# EAGLE design base1.1 (EAGLE 5.06)

## Sheet 1 of 3
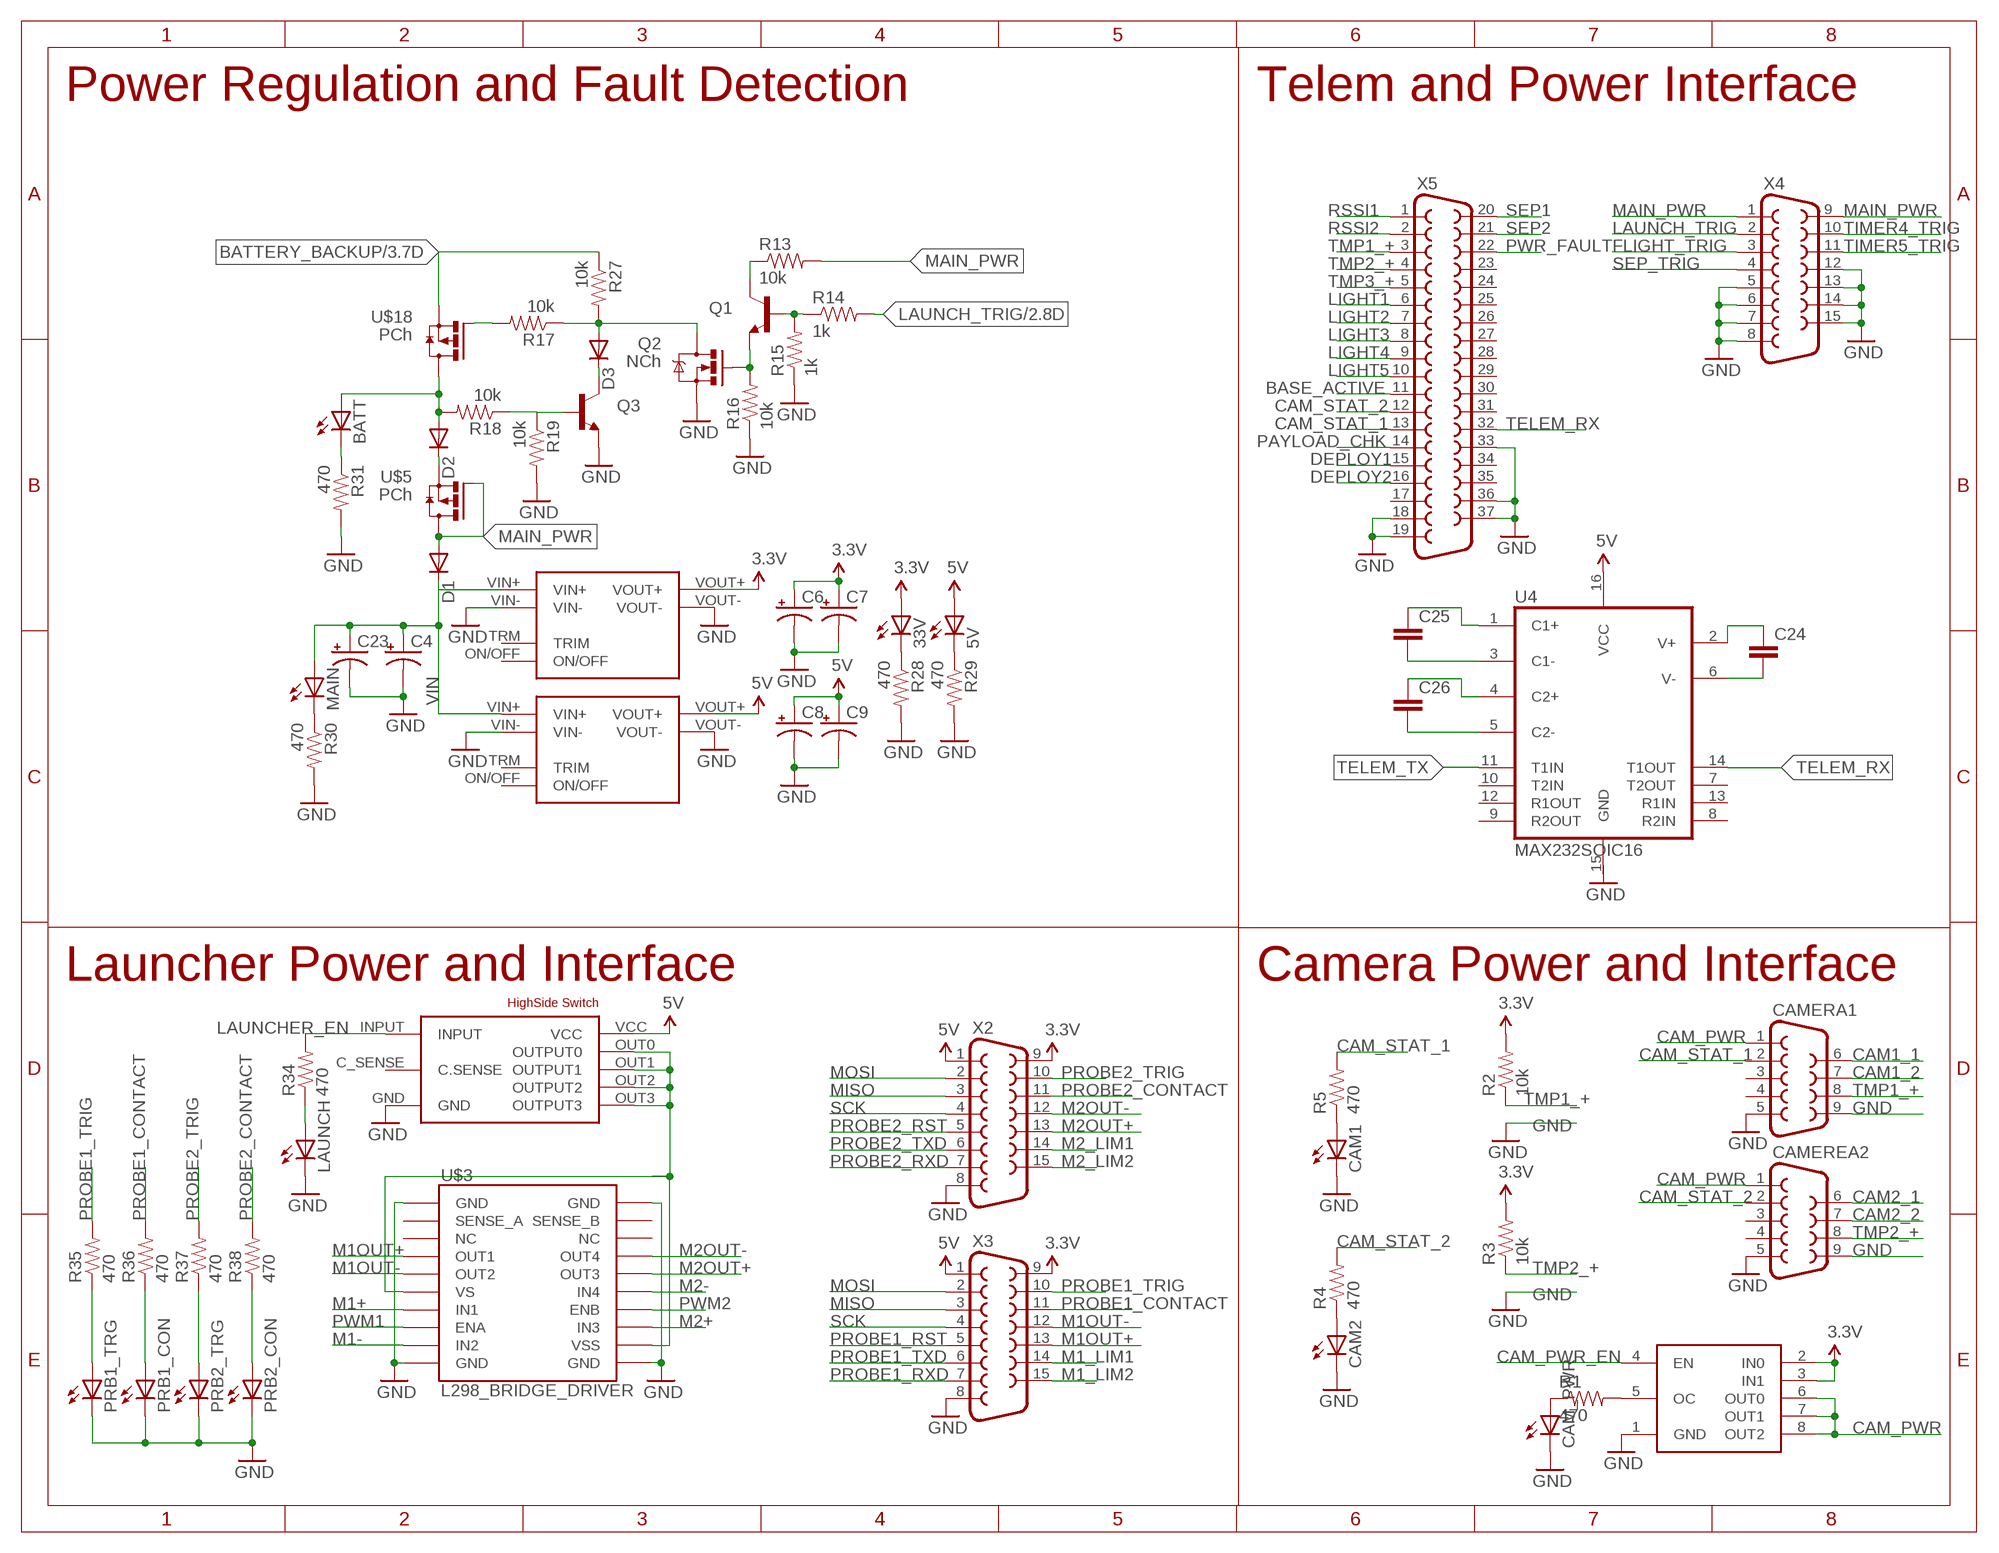
[diagram p0: schematic, sheet 1]

### Parts
3.3V  UEI15-033-Q12  [UEI15]
5.0V  UEI15-050-Q12  [UEI15]
5V  LEDCHIP-LED0805  [CHIP-LED0805]
33V  LEDCHIP-LED0805  [CHIP-LED0805]
BATT  LEDCHIP-LED0805  [CHIP-LED0805]
C4  CAP_POLF80  [NIPPON_F80]
C6  CAP_POLF80  [NIPPON_F80]
C7  CAP_POLF80  [NIPPON_F80]
C8  CAP_POLF80  [NIPPON_F80]
C9  CAP_POLF80  [NIPPON_F80]
C23  CAP_POLF80  [NIPPON_F80]
C24  CAP0805  [0805]
C25  CAP0805  [0805]
C26  CAP0805  [0805]
CAM1  LEDCHIP-LED0805  [CHIP-LED0805]
CAM2  LEDCHIP-LED0805  [CHIP-LED0805]
CAM_PWR  LEDCHIP-LED0805  [CHIP-LED0805]
CAMERA1  F09VB  [F09VB]
CAMEREA2  F09VB  [F09VB]
D1  DIODE-SMC  [SMC]
D2  DIODE-SMC  [SMC]
D3  DIODESOD  [SOD-323]
LAUNCH  LEDCHIP-LED0805  [CHIP-LED0805]
MAIN  LEDCHIP-LED0805  [CHIP-LED0805]
PRB1_CON  LEDCHIP-LED0805  [CHIP-LED0805]
PRB1_TRG  LEDCHIP-LED0805  [CHIP-LED0805]
PRB2_CON  LEDCHIP-LED0805  [CHIP-LED0805]
PRB2_TRG  LEDCHIP-LED0805  [CHIP-LED0805]
Q1  TRANSISTOR_NPNSOT23-3  [SOT23-3]
Q2  NCh  MOSFET-NCHANNELSMD  [SOT23-3]
Q3  TRANSISTOR_NPNSOT23-3  [SOT23-3]
R1  470  RESISTOR  [0805]
R2  10k  RESISTOR  [0805]
R3  10k  RESISTOR  [0805]
R4  470  RESISTOR  [0805]
R5  470  RESISTOR  [0805]
R13  10k  RESISTOR  [0805]
R14  1k  RESISTOR  [0805]
R15  1k  RESISTOR  [0805]
R16  10k  RESISTOR  [0805]
R17  10k  RESISTOR  [0805]
R18  10k  RESISTOR  [0805]
R19  10k  RESISTOR  [0805]
R27  10k  RESISTOR  [0805]
R28  470  RESISTOR  [0805]
R29  470  RESISTOR  [0805]
R30  470  RESISTOR  [0805]
R31  470  RESISTOR  [0805]
R34  470  RESISTOR  [0805]
R35  470  RESISTOR  [0805]
R36  470  RESISTOR  [0805]
R37  470  RESISTOR  [0805]
R38  470  RESISTOR  [0805]
U4  MAX232SOIC16  [SO016]
U$2  TPS2034D  [SO-08]
U$3  L298_BRIDGE_DRIVER  [POWERSO20]
U$5  PCh  IRFR5505  [D-PAK_TO252AA]
U$17  VN920SP  [POWERS0-10]
U$18  PCh  IRFR5505  [D-PAK_TO252AA]
X2  F15VB  [F15VB]
X3  F15VB  [F15VB]
X4  F15VB  [F15VB]
X5  F37VB  [F37VB]

### Nets
3.3V: 3.3V.VOUT+ 33V.A C6.+ C7.+ R2.2 R3.2 U$2.2(IN0) U$2.3(IN1) X2.9 X3.9 ; also sheet 2,3
5V: 5.0V.VOUT+ 5V.A C8.+ C9.+ U4.16(VCC) U$17.VCC X2.1 X3.1 ; also sheet 2,3
BASE_ACTIVE: X5.11
BATTERY_BACKUP: R27.1 U$18.3(S) ; also sheet 3
CAM1_1: CAMERA1.6 ; also sheet 2
CAM1_2: CAMERA1.7 ; also sheet 2
CAM2_1: CAMEREA2.6 ; also sheet 2
CAM2_2: CAMEREA2.7 ; also sheet 2
CAM_PWR: CAMERA1.1 CAMEREA2.1 U$2.6(OUT0) U$2.7(OUT1) U$2.8(OUT2)
CAM_PWR_EN: U$2.4(EN) ; also sheet 2
CAM_STAT_1: CAMERA1.2 R5.2 X5.13 ; also sheet 2
CAM_STAT_2: CAMEREA2.2 R4.2 X5.12 ; also sheet 2
DEPLOY1: X5.15
DEPLOY2: X5.16
FLIGHT_TRIG: X4.3 ; also sheet 2
GND: 3.3V.VIN- 3.3V.VOUT- 5.0V.VIN- 5.0V.VOUT- C4.- C6.- C7.- C8.- C9.- C23.- CAM1.C CAM2.C CAM_PWR.C CAMERA1.5 CAMERA1.9 CAMEREA2.5 CAMEREA2.9 LAUNCH.C PRB1_CON.C PRB1_TRG.C PRB2_CON.C PRB2_TRG.C Q2.2(S) Q3.2(E) R15.1 R16.1 R19.2 R28.2 R29.2 R30.2 R31.2 U$2.1(GND) U$3.P$1(GND) U$3.P$10(GND) U$3.P$11(GND) U$3.P$20(GND) U$17.GND X2.8 X3.8 X4.5 X4.6 X4.7 X4.8 X4.12 X4.13 X4.14 X4.15 X5.18 X5.19 X5.33 X5.36 X5.37 ; also sheet 2,3
LAUNCH_TRIG: R14.2 X4.2 ; also sheet 2
LAUNCHER_EN: R34.2 U$17.INPUT
LIGHT1: X5.6 ; also sheet 2,3
LIGHT2: X5.7 ; also sheet 2,3
LIGHT3: X5.8 ; also sheet 2,3
LIGHT4: X5.9 ; also sheet 2,3
LIGHT5: X5.10
M1+: U$3.P$7(IN1) ; also sheet 2
M1-: U$3.P$9(IN2) ; also sheet 2
M1_LIM1: X3.14
M1_LIM2: X3.15
M1OUT+: U$3.P$4(OUT1) X3.13
M1OUT-: U$3.P$5(OUT2) X3.12
M2+: U$3.P$13(IN3) ; also sheet 2
M2-: U$3.P$15(IN4) ; also sheet 2
M2_LIM1: X2.14
M2_LIM2: X2.15
M2OUT+: U$3.P$16(OUT3) X2.13
M2OUT-: U$3.P$17(OUT4) X2.12
MAIN_PWR: D1.A R13.2 U$5.1(G) U$5.4(D) X4.1 X4.9
MISO: X2.3 X3.3 ; also sheet 2,3
MOSI: X2.2 X3.2 ; also sheet 2,3
N$1: R1.2 U$2.5(OC)
N$2: CAM_PWR.A R1.1
N$3: CAM1.A R5.1
N$4: CAM2.A R4.1
N$6: Q1.2(E) Q2.1(G) R16.2
N$8: D2.C U$5.3(S)
N$15: BATT.A D2.A R18.2 U$18.4(D)
N$16: Q1.3(C) R13.1
N$18: Q1.1(B) R14.1 R15.2
N$19: D3.1(C) Q3.3(C)
N$23: R17.2 U$18.1(G)
N$25: U$3.P$6(VS) U$3.P$12(VSS) U$17.OUT0(OUTPUT0) U$17.OUT1(OUTPUT1) U$17.OUT2(OUTPUT2) U$17.OUT3(OUTPUT3)
N$26: Q3.1(B) R18.1 R19.1
N$44: D3.2(A) Q2.3(D) R17.1 R27.2
N$48: 33V.C R28.1
N$49: 5V.C R29.1
N$50: MAIN.C R30.1
N$51: BATT.C R31.1
N$52: LAUNCH.A R34.1
N$54: C25.1 U4.1(C1+)
N$55: C25.2 U4.3(C1-)
N$56: C26.2 U4.5(C2-)
N$57: C26.1 U4.4(C2+)
N$58: C24.1 U4.2(V+)
N$59: C24.2 U4.6(V-)
N$60: PRB1_TRG.A R35.1
N$61: PRB1_CON.A R36.1
N$62: PRB2_TRG.A R37.1
N$63: PRB2_CON.A R38.1
PAYLOAD_CHK: X5.14
PROBE1_CONTACT: R36.2 X3.11 ; also sheet 2
PROBE1_RST: X3.5 ; also sheet 3
PROBE1_RXD: X3.7 ; also sheet 3
PROBE1_TRIG: R35.2 X3.10 ; also sheet 2,3
PROBE1_TXD: X3.6 ; also sheet 3
PROBE2_CONTACT: R38.2 X2.11 ; also sheet 2
PROBE2_RST: X2.5 ; also sheet 3
PROBE2_RXD: X2.7 ; also sheet 3
PROBE2_TRIG: R37.2 X2.10 ; also sheet 2,3
PROBE2_TXD: X2.6 ; also sheet 3
PWM1: U$3.P$8(ENA) ; also sheet 2
PWM2: U$3.P$14(ENB) ; also sheet 2
PWR_FAULT: X5.22
RSSI1: X5.1 ; also sheet 2
RSSI2: X5.2 ; also sheet 2
SCK: X2.4 X3.4 ; also sheet 2,3
SEP1: X5.20
SEP2: X5.21
SEP_TRIG: X4.4 ; also sheet 2
TELEM_RX: U4.14(T1OUT) X5.32
TELEM_TX: U4.11(T1IN) ; also sheet 2
TIMER4_TRIG: X4.10
TIMER5_TRIG: X4.11
TMP1_+: CAMERA1.8 R2.1 X5.3
TMP2_+: CAMEREA2.8 R3.1 X5.4
TMP3_+: X5.5
VIN: 3.3V.VIN+ 5.0V.VIN+ C4.+ C23.+ D1.C MAIN.A
Unconnected: 3.3V.ON/OFF 3.3V.TRM(TRIM) 5.0V.ON/OFF 5.0V.TRM(TRIM) CAMERA1.3 CAMERA1.4 CAMEREA2.3 CAMEREA2.4 U4.7(T2OUT) U4.8(R2IN) U4.9(R2OUT) U4.10(T2IN) U4.12(R1OUT) U4.13(R1IN) U4.15(GND) U$3.P$2(SENSE_A) U$3.P$3(NC) U$3.P$18(NC) U$3.P$19(SENSE_B) U$17.C_SENSE(C.SENSE) X5.17 X5.23 X5.24 X5.25 X5.26 X5.27 X5.28 X5.29 X5.30 X5.31 X5.34 X5.35

### Notes on the sheet
- Power Regulation and Fault Detection | Telem and Power Interface
- Launcher Power and Interface | Camera Power and Interface

## Sheet 2 of 3
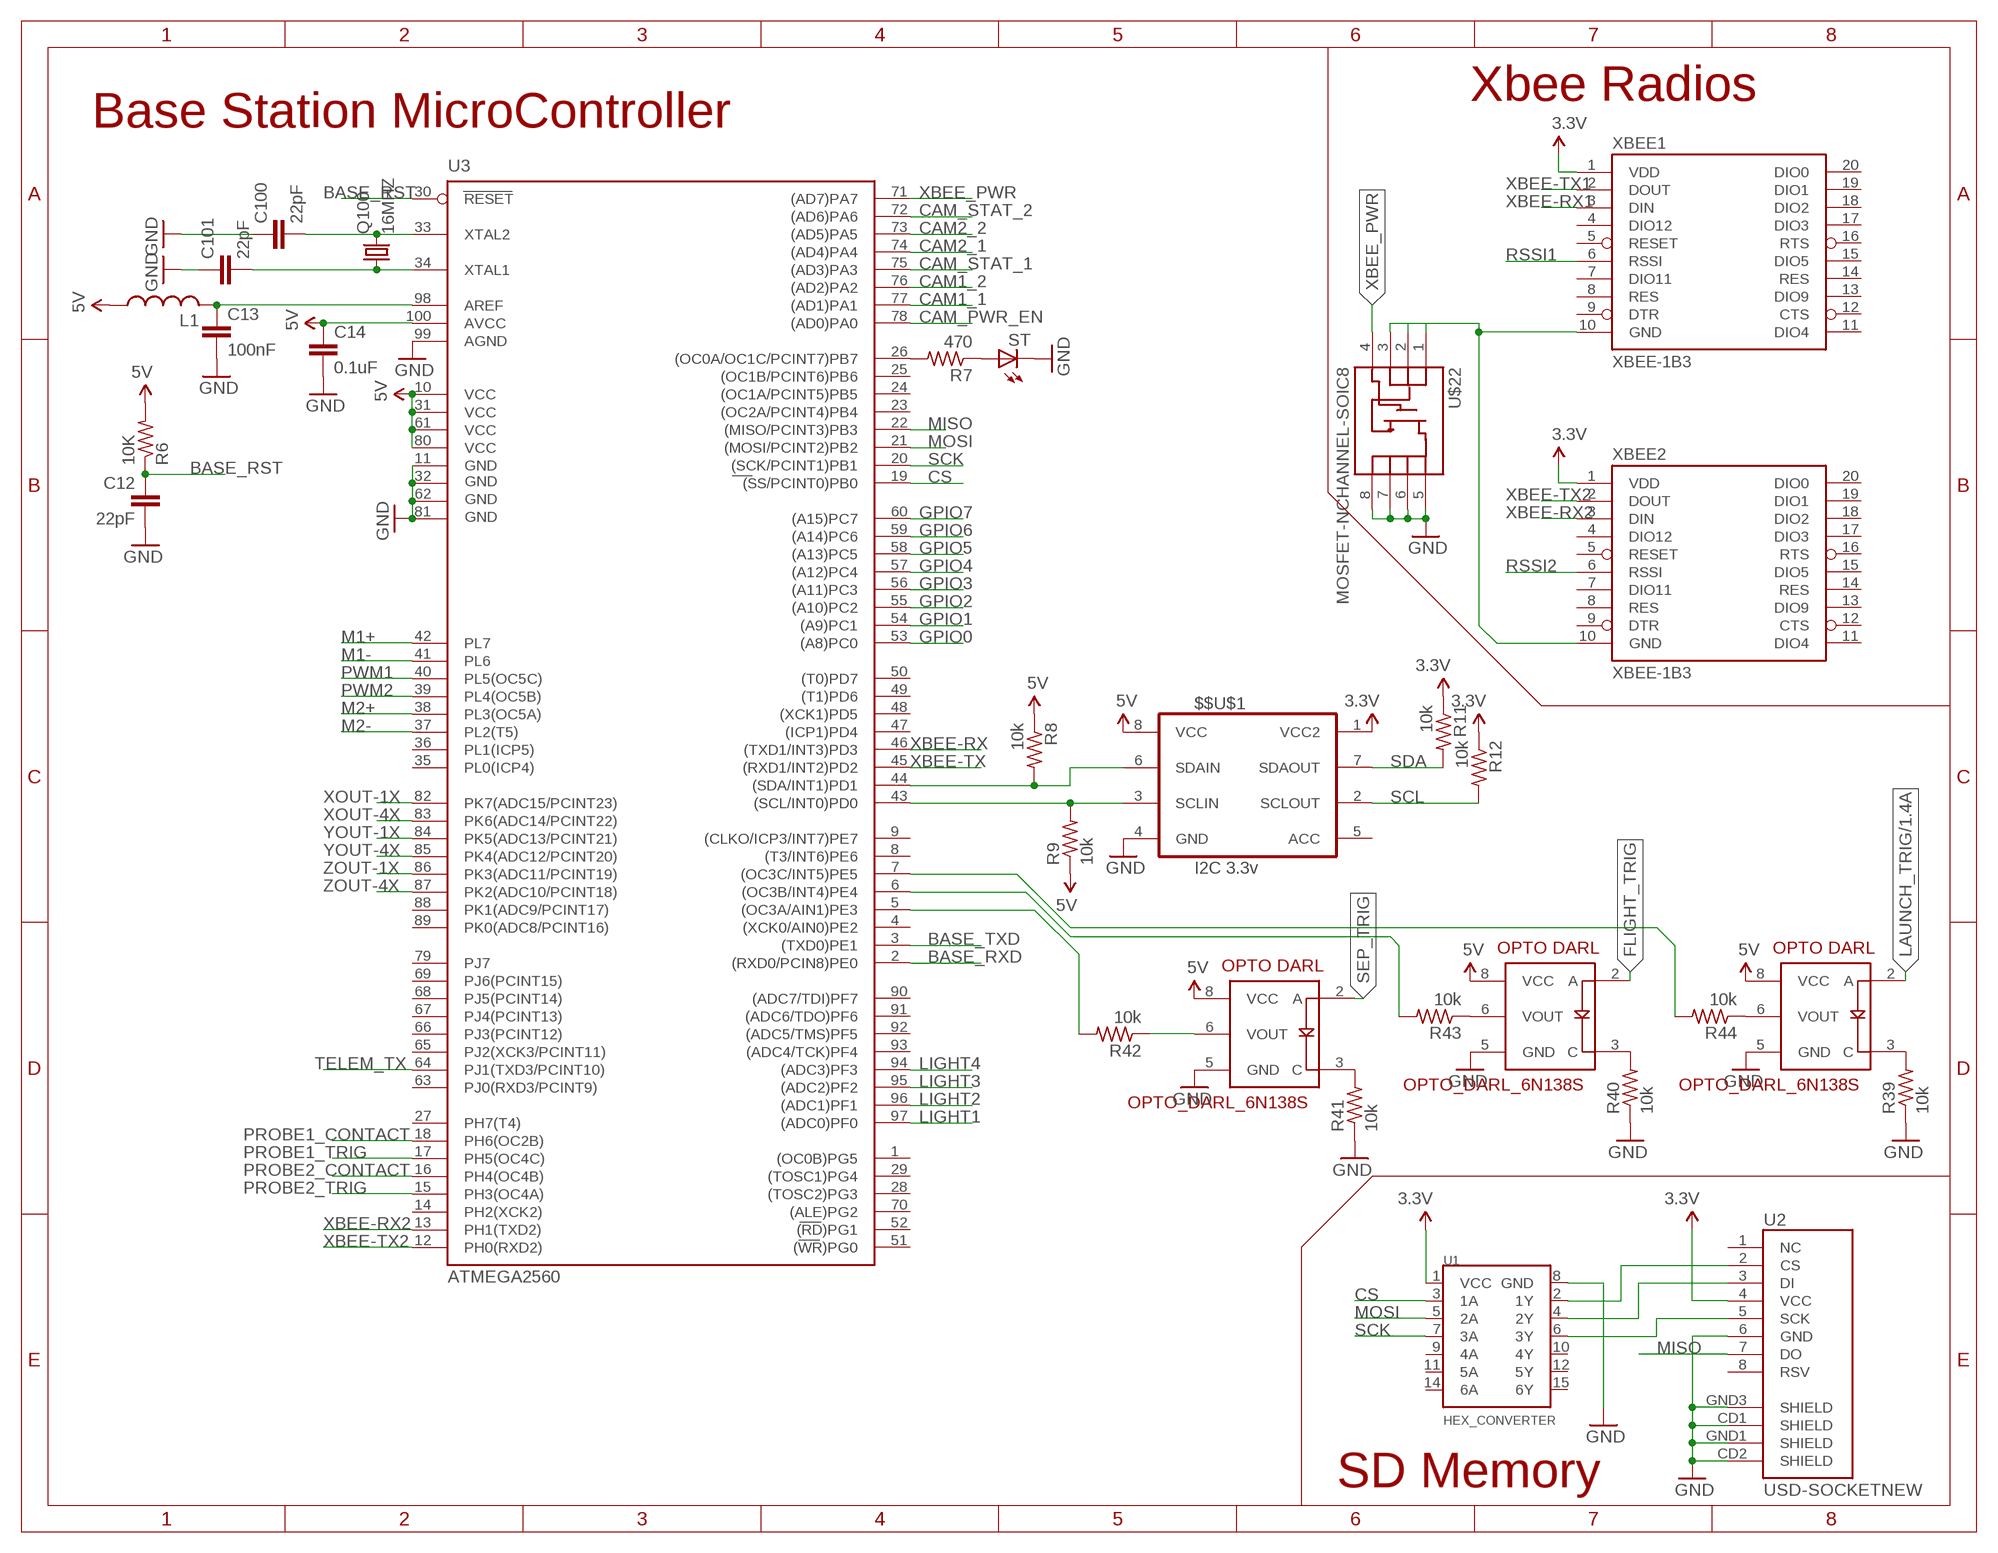
[diagram p1: schematic, sheet 2]

### Parts
$$U$1  I2C 3.3v  CUSTOM2_PCA9512A  [CUSTOM2_SO08]
C12  22pF  C-EUC0805K  [C0805K]
C13  100nF  C-EUC0805K  [C0805K]
C14  0.1uF  C-EUC0805K  [C0805K]
C100  22pF  C-EUC0805K  [C0805K]
C101  22pF  C-EUC0805K  [C0805K]
L1  L-USL2012C  [L2012C]
Q100  16MHZ  CRYSTAL5X3  [CRYSTAL-SMD-5X3]
R6  10K  R-US_M0805  [M0805]
R7  470  R-US_M0805  [M0805]
R8  10k  R-US_M0805  [M0805]
R9  10k  R-US_M0805  [M0805]
R11  10k  R-US_M0805  [M0805]
R12  10k  R-US_M0805  [M0805]
R39  10k  R-US_M0805  [M0805]
R40  10k  R-US_M0805  [M0805]
R41  10k  R-US_M0805  [M0805]
R42  10k  R-US_M0805  [M0805]
R43  10k  R-US_M0805  [M0805]
R44  10k  R-US_M0805  [M0805]
ST  LED1206  [LED-1206]
U1  HEX_CONVERTER  [SO016]
U2  USD-SOCKETNEW  [MICRO-SD-SOCKET-PP]
U3  ATMEGA2560  ATMEGA2560-16AU  [TQFP100]
U$22  MOSFET-NCHANNEL-SOIC8  [SO08]
U$28  OPTO_DARL_6N138S  [8-SMD]
U$29  OPTO_DARL_6N138S  [8-SMD]
U$30  OPTO_DARL_6N138S  [8-SMD]
XBEE1  XBEE-1B3  [XBEE-SMD]
XBEE2  XBEE-1B3  [XBEE-SMD]

### Nets
3.3V: $$U$1.1(VCC2) R11.1 R12.1 U1.1(VCC) U2.4(VCC) XBEE1.1(VDD) XBEE2.1(VDD) ; also sheet 1,3
5V: $$U$1.8(VCC) C14.1 L1.1 R6.2 R8.1 R9.1 U3.10(VCC) U3.31(VCC1) U3.61(VCC2) U3.80(VCC3) U3.100(AVCC) U$28.8(VCC) U$29.8(VCC) U$30.8(VCC) ; also sheet 1,3
BASE_RST: C12.1 R6.1 U3.30(RESET) ; also sheet 3
BASE_RXD: U3.2((RXD0/PCIN8)PE0) ; also sheet 3
BASE_TXD: U3.3((TXD0)PE1) ; also sheet 3
CAM1_1: U3.77((AD1)PA1) ; also sheet 1
CAM1_2: U3.76((AD2)PA2) ; also sheet 1
CAM2_1: U3.74((AD4)PA4) ; also sheet 1
CAM2_2: U3.73((AD5)PA5) ; also sheet 1
CAM_PWR_EN: U3.78((AD0)PA0) ; also sheet 1
CAM_STAT_1: U3.75((AD3)PA3) ; also sheet 1
CAM_STAT_2: U3.72((AD6)PA6) ; also sheet 1
CS: U1.3(1A) U3.19((SS/PCINT0)PB0)
FLIGHT_TRIG: U$29.2(A) ; also sheet 1
GND: $$U$1.4(GND) C12.2 C13.2 C14.2 C100.1 C101.1 R39.1 R40.1 R41.1 ST.C U1.8(GND) U2.6(GND) U2.CD1(SHIELD) U2.CD2(SHIELD) U2.GND1(SHIELD) U2.GND3(SHIELD) U3.11(GND) U3.32(GND1) U3.62(GND2) U3.81(GND3) U3.99(AGND) U$22.5(D) U$22.6(D) U$22.7(D) U$22.8(D) U$28.5(GND) U$29.5(GND) U$30.5(GND) ; also sheet 1,3
GPIO0: U3.53((A8)PC0) ; also sheet 3
GPIO1: U3.54((A9)PC1) ; also sheet 3
GPIO2: U3.55((A10)PC2) ; also sheet 3
GPIO3: U3.56((A11)PC3) ; also sheet 3
GPIO4: U3.57((A12)PC4)
GPIO5: U3.58((A13)PC5)
GPIO6: U3.59((A14)PC6)
GPIO7: U3.60((A15)PC7)
LAUNCH_TRIG: U$30.2(A) ; also sheet 1
LIGHT1: U3.97((ADC0)PF0) ; also sheet 1,3
LIGHT2: U3.96((ADC1)PF1) ; also sheet 1,3
LIGHT3: U3.95((ADC2)PF2) ; also sheet 1,3
LIGHT4: U3.94((ADC3)PF3) ; also sheet 1,3
M1+: U3.42(PL7) ; also sheet 1
M1-: U3.41(PL6) ; also sheet 1
M2+: U3.38(PL3(OC5A)) ; also sheet 1
M2-: U3.37(PL2(T5)) ; also sheet 1
MISO: U2.7(DO) U3.22((MISO/PCINT3)PB3) ; also sheet 1,3
MOSI: U1.5(2A) U3.21((MOSI/PCINT2)PB2) ; also sheet 1,3
N$5: $$U$1.3(SCLIN) R9.2 U3.43((SCL/INT0)PD0)
N$7: C13.1 L1.2 U3.98(AREF)
N$9: $$U$1.6(SDAIN) R8.2 U3.44((SDA/INT1)PD1)
N$10: U1.2(1Y) U2.2(CS)
N$11: U1.4(2Y) U2.3(DI)
N$12: U1.6(3Y) U2.5(SCK)
N$13: C100.2 Q100.3 U3.33(XTAL2)
N$14: C101.2 Q100.1 U3.34(XTAL1)
N$29: R7.2 U3.26((OC0A/OC1C/PCINT7)PB7)
N$30: R7.1 ST.A
N$35: R44.2 U3.7((OC3C/INT5)PE5)
N$36: R43.2 U3.6((OC3B/INT4)PE4)
N$37: R42.2 U3.5((OC3A/AIN1)PE3)
N$38: R39.2 U$30.3(C)
N$39: R40.2 U$29.3(C)
N$40: R41.2 U$28.3(C)
N$41: R42.1 U$28.6(VOUT)
N$43: R44.1 U$30.6(VOUT)
N$53: U$22.1(S) U$22.2(S) U$22.3(S) XBEE1.10(GND) XBEE2.10(GND)
N$64: R43.1 U$29.6(VOUT)
PROBE1_CONTACT: U3.18(PH6(OC2B)) ; also sheet 1
PROBE1_TRIG: U3.17(PH5(OC4C)) ; also sheet 1,3
PROBE2_CONTACT: U3.16(PH4(OC4B)) ; also sheet 1
PROBE2_TRIG: U3.15(PH3(OC4A)) ; also sheet 1,3
PWM1: U3.40(PL5(OC5C)) ; also sheet 1
PWM2: U3.39(PL4(OC5B)) ; also sheet 1
RSSI1: XBEE1.6(RSSI) ; also sheet 1
RSSI2: XBEE2.6(RSSI) ; also sheet 1
SCK: U1.7(3A) U3.20((SCK/PCINT1)PB1) ; also sheet 1,3
SCL: $$U$1.2(SCLOUT) R12.2 ; also sheet 3
SDA: $$U$1.7(SDAOUT) R11.2 ; also sheet 3
SEP_TRIG: U$28.2(A) ; also sheet 1
TELEM_TX: U3.64(PJ1(TXD3/PCINT10)) ; also sheet 1
XBEE-RX: U3.46((TXD1/INT3)PD3)
XBEE-RX1: XBEE1.3(DIN)
XBEE-RX2: U3.13(PH1(TXD2)) XBEE2.3(DIN)
XBEE-TX: U3.45((RXD1/INT2)PD2)
XBEE-TX1: XBEE1.2(DOUT)
XBEE-TX2: U3.12(PH0(RXD2)) XBEE2.2(DOUT)
XBEE_PWR: U$22.4(G)
XOUT-1X: U3.82(PK7(ADC15/PCINT23)) ; also sheet 3
XOUT-4X: U3.83(PK6(ADC14/PCINT22)) ; also sheet 3
YOUT-1X: U3.84(PK5(ADC13/PCINT21)) ; also sheet 3
YOUT-4X: U3.85(PK4(ADC12/PCINT20)) ; also sheet 3
ZOUT-1X: U3.86(PK3(ADC11/PCINT19)) ; also sheet 3
ZOUT-4X: U3.87(PK2(ADC10/PCINT18)) ; also sheet 3
Unconnected: $$U$1.5(ACC) U1.9(4A) U1.10(4Y) U1.11(5A) U1.12(5Y) U1.14(6A) U1.15(6Y) U2.1(NC) U2.8(RSV) U3.1((OC0B)PG5) U3.4((XCK0/AIN0)PE2) U3.8((T3/INT6)PE6) U3.9((CLKO/ICP3/INT7)PE7) U3.14(PH2(XCK2)) U3.23((OC2A/PCINT4)PB4) U3.24((OC1A/PCINT5)PB5) U3.25((OC1B/PCINT6)PB6) U3.27(PH7(T4)) U3.28((TOSC2)PG3) U3.29((TOSC1)PG4) U3.35(PL0(ICP4)) U3.36(PL1(ICP5)) U3.47((ICP1)PD4) U3.48((XCK1)PD5) U3.49((T1)PD6) U3.50((T0)PD7) U3.51((WR)PG0) U3.52((RD)PG1) U3.63(PJ0(RXD3/PCINT9)) U3.65(PJ2(XCK3/PCINT11)) U3.66(PJ3(PCINT12)) U3.67(PJ4(PCINT13)) U3.68(PJ5(PCINT14)) U3.69(PJ6(PCINT15)) U3.70((ALE)PG2) U3.71((AD7)PA7) U3.79(PJ7) U3.88(PK1(ADC9/PCINT17)) U3.89(PK0(ADC8/PCINT16)) U3.90((ADC7/TDI)PF7) U3.91((ADC6/TDO)PF6) U3.92((ADC5/TMS)PF5) U3.93((ADC4/TCK)PF4) XBEE1.4(DIO12) XBEE1.5(RESET) XBEE1.7(DIO11) XBEE1.8(RES) XBEE1.9(DTR) XBEE1.11(DIO4) XBEE1.12(CTS) XBEE1.13(DIO9) XBEE1.14(RES) XBEE1.15(DIO5) XBEE1.16(RTS) XBEE1.17(DIO3) XBEE1.18(DIO2) XBEE1.19(DIO1) XBEE1.20(DIO0) XBEE2.4(DIO12) XBEE2.5(RESET) XBEE2.7(DIO11) XBEE2.8(RES) XBEE2.9(DTR) XBEE2.11(DIO4) XBEE2.12(CTS) XBEE2.13(DIO9) XBEE2.14(RES) XBEE2.15(DIO5) XBEE2.16(RTS) XBEE2.17(DIO3) XBEE2.18(DIO2) XBEE2.19(DIO1) XBEE2.20(DIO0)

### Notes on the sheet
- Xbee Radios
- Base Station MicroController
- SD Memory

## Sheet 3 of 3
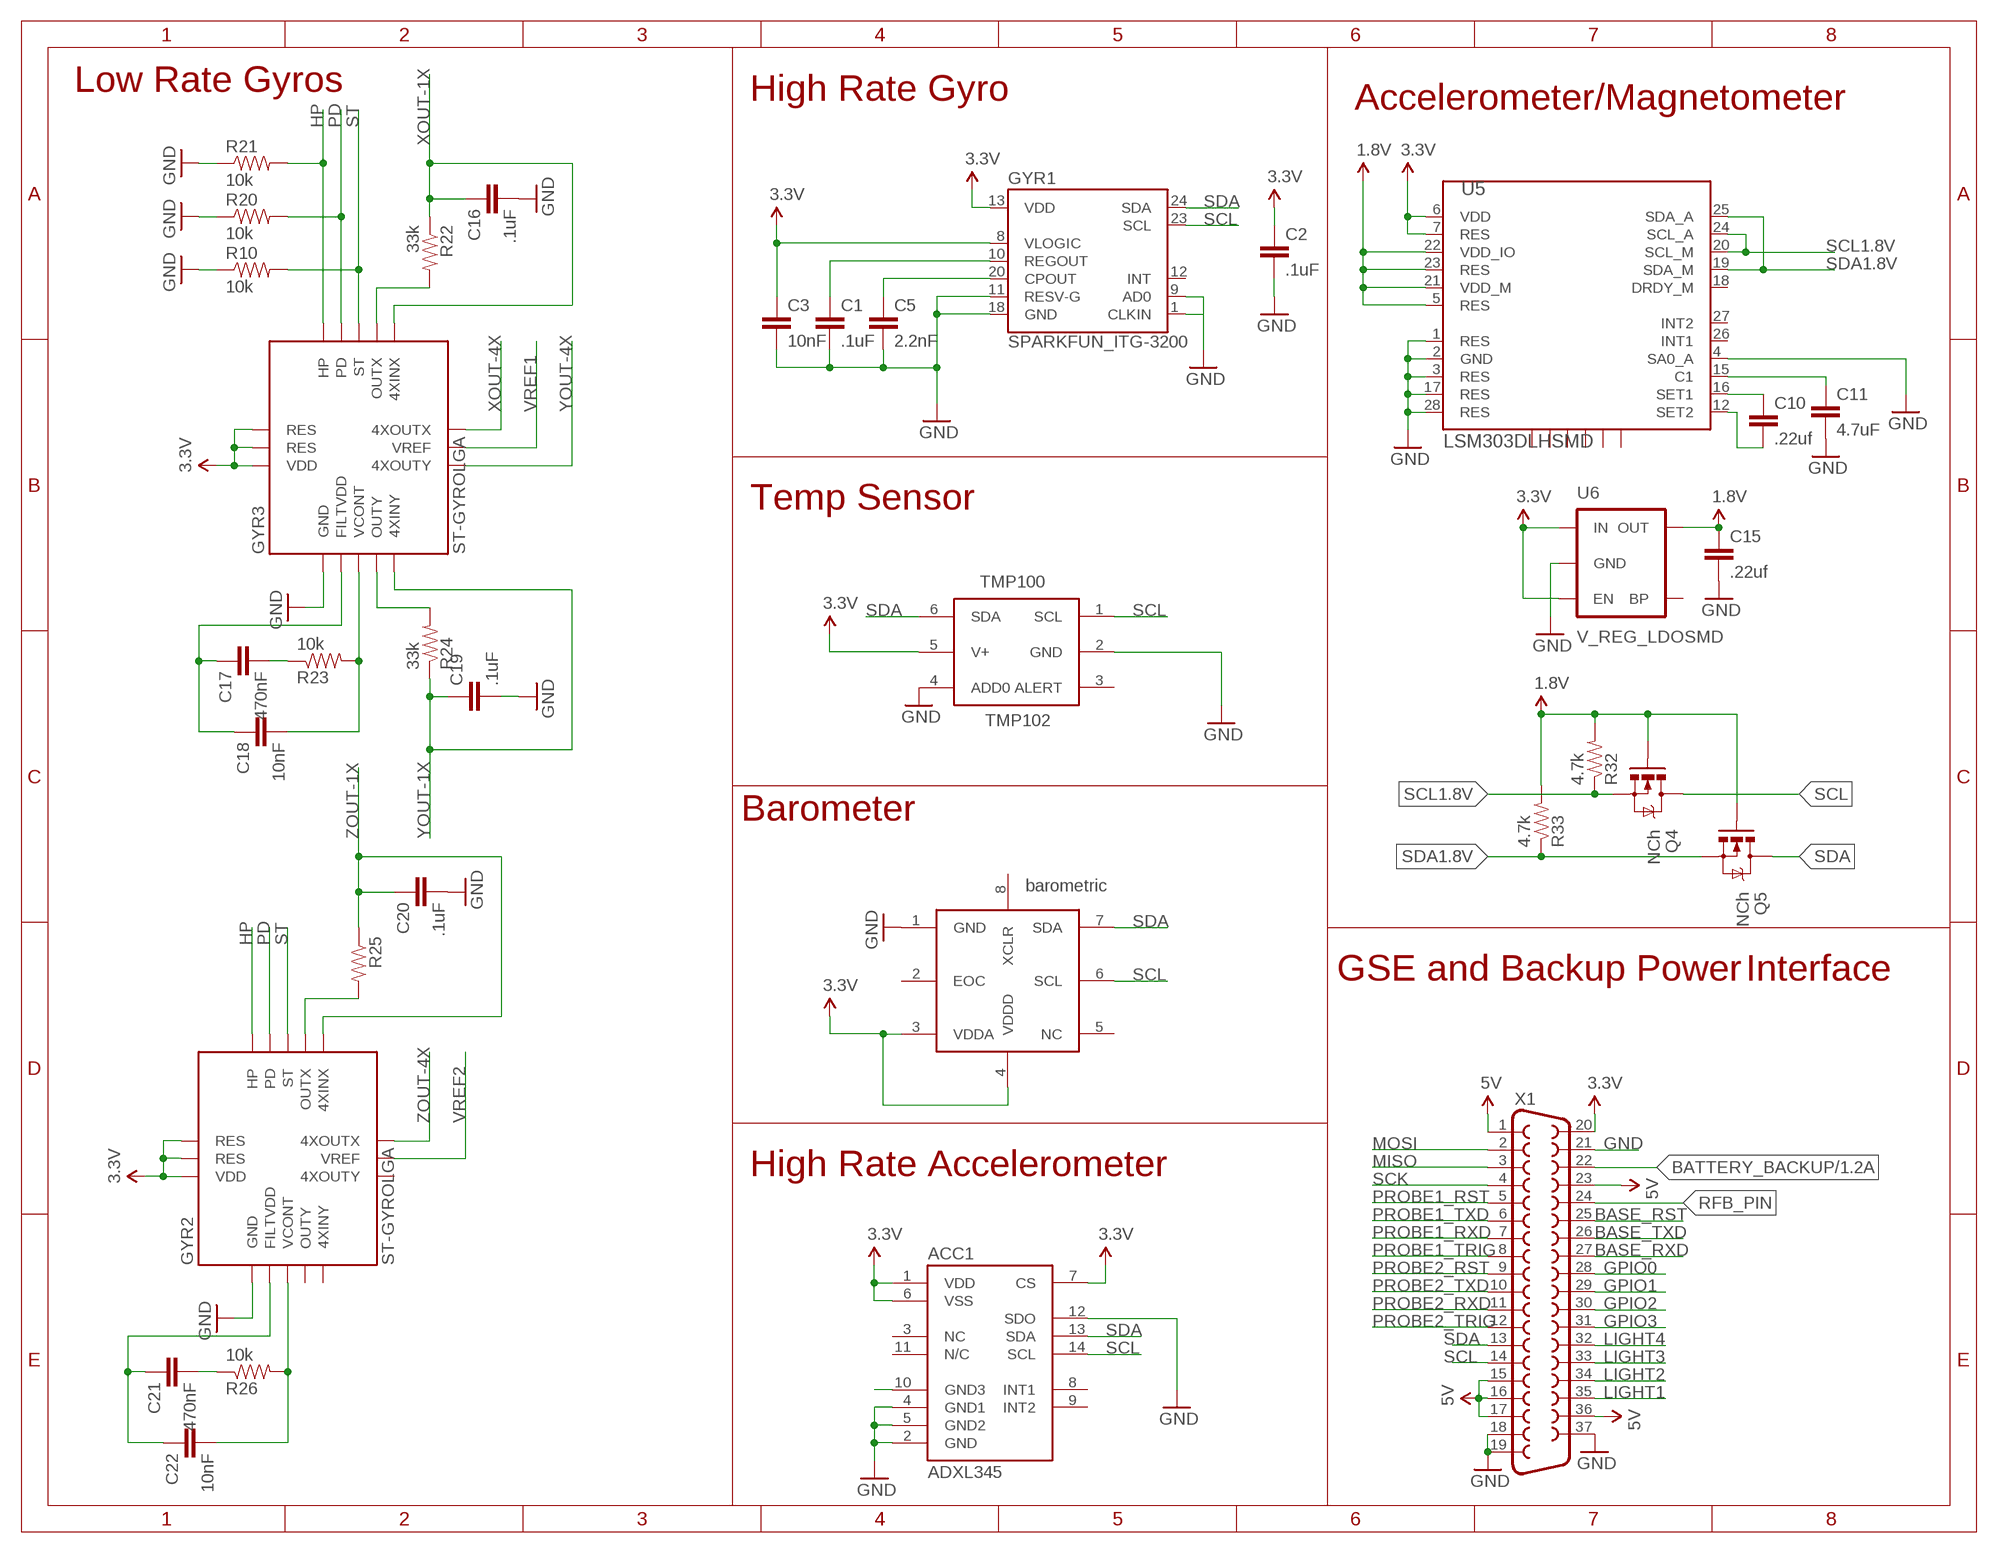
[diagram p2: schematic, sheet 3]

### Parts
ACC1  ADXL345  [LGA14]
BAR100  BMP085  [BMP085]
C1  .1uF  C-EUC0805  [C0805]
C2  .1uF  C-EUC0805  [C0805]
C3  10nF  C-EUC0805  [C0805]
C5  2.2nF  C-EUC0805  [C0805]
C10  .22uf  C-EUC0805  [C0805]
C11  4.7uF  C-EUC0805  [C0805]
C15  .22uf  C-EUC0805  [C0805]
C16  .1uF  C-EUC0805  [C0805]
C17  470nF  C-EUC0805  [C0805]
C18  10nF  C-EUC0805  [C0805]
C19  .1uF  C-EUC0805  [C0805]
C20  .1uF  C-EUC0805  [C0805]
C21  470nF  C-EUC0805  [C0805]
C22  10nF  C-EUC0805  [C0805]
GYR1  SPARKFUN_ITG-3200  [SPARKFUN_QFN-24]
GYR2  ST-GYROLGA  [ST-GYRO]
GYR3  ST-GYROLGA  [ST-GYRO]
Q4  NCh  MOSFET-NCHANNELSMD  [SOT23-3]
Q5  NCh  MOSFET-NCHANNELSMD  [SOT23-3]
R10  10k  RESISTOR  [0805]
R20  10k  RESISTOR  [0805]
R21  10k  RESISTOR  [0805]
R22  33k  RESISTOR  [0805]
R23  10k  RESISTOR  [0805]
R24  33k  RESISTOR  [0805]
R25  RESISTOR  [0805]
R26  10k  RESISTOR  [0805]
R32  4.7k  RESISTOR  [0805]
R33  4.7k  RESISTOR  [0805]
TMP100  TMP102  [SOT563]
U5  LSM303DLHSMD  [LGA28-5X5]
U6  V_REG_LDOSMD  [SOT23-5]
X1  F37VB  [F37VB]

### Nets
1.8V: C15.1 Q4.1(G) Q5.1(G) R32.2 R33.2 U5.5(RES) U5.21(VDD_M) U5.22(VDD_IO) U5.23(RES) U6.5(OUT)
3.3V: ACC1.1(VDD) ACC1.6(VSS) ACC1.7(CS) BAR100.3(VDDA) BAR100.4(VDDD) C2.1 C3.1 GYR1.8(VLOGIC) GYR1.13(VDD) GYR2.14(RES) GYR2.15(RES) GYR2.16(VDD) GYR3.14(RES) GYR3.15(RES) GYR3.16(VDD) TMP100.5(V+) U5.6(VDD) U5.7(RES) U6.1(IN) U6.3(EN) X1.20 ; also sheet 1,2
5V: X1.1 X1.15 X1.16 X1.17 X1.23 X1.36 ; also sheet 1,2
BASE_RST: X1.25 ; also sheet 2
BASE_RXD: X1.27 ; also sheet 2
BASE_TXD: X1.26 ; also sheet 2
BATTERY_BACKUP: X1.22 ; also sheet 1
GND: ACC1.2(GND) ACC1.4(GND1) ACC1.5(GND2) ACC1.12(SDO) BAR100.1(GND) C1.2 C2.2 C3.2 C5.2 C11.2 C15.2 C16.2 C19.2 C20.2 GYR1.1(CLKIN) GYR1.9(AD0) GYR1.11(RESV-G) GYR1.18(GND) GYR2.1(GND) GYR3.1(GND) R10.1 R20.1 R21.1 TMP100.2(GND) TMP100.4(ADD0) U5.1(RES) U5.2(GND) U5.3(RES) U5.4(SA0_A) U5.17(RES) U5.28(RES) U6.2(GND) X1.18 X1.19 X1.21 X1.37 ; also sheet 1,2
GPIO0: X1.28 ; also sheet 2
GPIO1: X1.29 ; also sheet 2
GPIO2: X1.30 ; also sheet 2
GPIO3: X1.31 ; also sheet 2
HP: GYR2.13(HP) GYR3.13(HP) R21.2
LIGHT1: X1.35 ; also sheet 1,2
LIGHT2: X1.34 ; also sheet 1,2
LIGHT3: X1.33 ; also sheet 1,2
LIGHT4: X1.32 ; also sheet 1,2
MISO: X1.3 ; also sheet 1,2
MOSI: X1.2 ; also sheet 1,2
N$17: C10.1 U5.16(SET1)
N$20: ACC1.10(GND3)
N$21: C5.1 GYR1.20(CPOUT)
N$22: C1.1 GYR1.10(REGOUT)
N$24: C10.2 U5.12(SET2)
N$27: C11.1 U5.15(C1)
N$28: GYR3.10(OUTX) R22.2
N$31: C17.1 C18.1 GYR3.2(FILTVDD)
N$32: C17.2 R23.1
N$33: C18.2 GYR3.3(VCONT) R23.2
N$34: GYR3.4(OUTY) R24.2
N$42: GYR2.10(OUTX) R25.2
N$45: C21.1 C22.1 GYR2.2(FILTVDD)
N$46: C21.2 R26.1
N$47: C22.2 GYR2.3(VCONT) R26.2
PD: GYR2.12(PD) GYR3.12(PD) R20.2
PROBE1_RST: X1.5 ; also sheet 1
PROBE1_RXD: X1.7 ; also sheet 1
PROBE1_TRIG: X1.8 ; also sheet 1,2
PROBE1_TXD: X1.6 ; also sheet 1
PROBE2_RST: X1.9 ; also sheet 1
PROBE2_RXD: X1.11 ; also sheet 1
PROBE2_TRIG: X1.12 ; also sheet 1,2
PROBE2_TXD: X1.10 ; also sheet 1
RFB_PIN: X1.24
SCK: X1.4 ; also sheet 1,2
SCL: ACC1.14(SCL) BAR100.6(SCL) GYR1.23(SCL) Q4.3(D) TMP100.1(SCL) X1.14 ; also sheet 2
SCL1.8V: Q4.2(S) R32.1 U5.20(SCL_M) U5.24(SCL_A)
SDA: ACC1.13(SDA) BAR100.7(SDA) GYR1.24(SDA) Q5.3(D) TMP100.6(SDA) X1.13 ; also sheet 2
SDA1.8V: Q5.2(S) R33.1 U5.19(SDA_M) U5.25(SDA_A)
ST: GYR2.11(ST) GYR3.11(ST) R10.2
VREF1: GYR3.7(VREF)
VREF2: GYR2.7(VREF)
XOUT-1X: C16.1 GYR3.9(4XINX) R22.1 ; also sheet 2
XOUT-4X: GYR3.8(4XOUTX) ; also sheet 2
YOUT-1X: C19.1 GYR3.5(4XINY) R24.1 ; also sheet 2
YOUT-4X: GYR3.6(4XOUTY) ; also sheet 2
ZOUT-1X: C20.1 GYR2.9(4XINX) R25.1 ; also sheet 2
ZOUT-4X: GYR2.8(4XOUTX) ; also sheet 2
Unconnected: ACC1.3(NC) ACC1.8(INT1) ACC1.9(INT2) ACC1.11(N/C) BAR100.2(EOC) BAR100.5(NC) BAR100.8(XCLR) GYR1.12(INT) GYR2.4(OUTY) GYR2.5(4XINY) GYR2.6(4XOUTY) TMP100.3(ALERT) U5.8(NC) U5.9(NC) U5.10(RES) U5.11(RES) U5.13(RES) U5.14(RES) U5.18(DRDY_M) U5.26(INT1) U5.27(INT2) U6.4(BP)

### Notes on the sheet
- Low Rate Gyros | High Rate Gyro
- Accelerometer/Magnetometer
- Temp Sensor
- Barometer
- barometric
- GSE and Backup Power | Interface
- High Rate Accelerometer

## Library data of the parts
3.3V = muRata:UEI15-033-Q12; VOLTAGE: 3.3v
5.0V = muRata:UEI15-050-Q12; VOLTAGE: 5.0v
5V 33V BATT CAM1 CAM2 CAM_PWR LAUNCH MAIN PRB1_CON PRB1_TRG PRB2_CON PRB2_TRG = led:LED: LED OSRAM: - CHIPLED LG R971, LG N971, LY N971, LG Q971, LY Q971, LO R971, LY R971 LH N974, LH R974 LS Q976, LO Q976, LY Q976 LO Q996 - Hyper CHIPLED LW Q18S LB Q993, LB Q99A, LB R99A - SideLED LS A670, LO A670, LY A670, LG A670, LP A670 LB A673, LV A673, LT A673, LW A673 LH A674 LY A675 LS A676, LA A676, LO A676, LY A676, LW A676 LS A679, LY A679, LG A679 - Hyper Micro SIDELED® LS Y876, LA Y876, LO Y876, LY Y876 LT Y87S - SmartLED LW L88C, LW L88S LB L89C, LB L89S, LG L890 LS L89K, LO L89K, LY L89K LS L896, LA L896, LO L896, LY L896 - TOPLED LS T670, LO T670, LY T670, LG T670, LP T670 LSG T670, LSP T670, LSY T670, LOP T670, LYG T670 LG T671, LOG T671, LSG T671 LB T673, LV T673, LT T673, LW T673 LH T674 LS T676, LA T676, LO T676, LY T676, LB T676, LH T676, LSB T676, LW T676 LB T67C, LV T67C, LT T67C, LS T67K, LO T67K, LY T67K, LW E67C LS E67B, LA E67B, LO E67B, LY E67B, LB E67C, LV E67C, LT E67C LW T67C LS T679, LY T679, LG T679 LS T770, LO T770, LY T770, LG T770, LP T770 LB T773, LV T773, LT T773, LW T773 LH T774 LS E675, LA E675, LY E675, LS T675 LS T776, LA T776, LO T776, LY T776, LB T776 LHGB T686 LT T68C, LB T68C - Hyper Mini TOPLED® LB M676 - Mini TOPLED Santana® LG M470 LS M47K, LO M47K, LY M47K Source: http://www.osram.convergy.de LUXEON: - LUMILED® LXK2-PW12-R00, LXK2-PW12-S00, LXK2-PW14-U00, LXK2-PW14-V00 LXK2-PM12-R00, LXK2-PM12-S00, LXK2-PM14-U00 LXK2-PE12-Q00, LXK2-PE12-R00, LXK2-PE12-S00, LXK2-PE14-T00, LXK2-PE14-U00 LXK2-PB12-K00, LXK2-PB12-L00, LXK2-PB12-M00, LXK2-PB14-N00, LXK2-PB14-P00, LXK2-PB14-Q00 LXK2-PR12-L00, LXK2-PR12-M00, LXK2-PR14-Q00, LXK2-PR14-R00 LXK2-PD12-Q00, LXK2-PD12-R00, LXK2-PD12-S00 LXK2-PH12-R00, LXK2-PH12-S00 LXK2-PL12-P00, LXK2-PL12-Q00, LXK2-PL12-R00 Source: www.luxeon.com KINGBRIGHT: KA-3528ASYC Source: www.kingbright.com
$$U$1 = interface-rev1_2:CUSTOM2_PCA9512A: Level Shifting I2C Voltage Translator
ACC1 = SparkFun:ADXL345
BAR100 = SparkFun:BMP085
C1-C3 C5 C10-C22 C100 C101 = rcl:C-EU: CAPACITOR, European symbol
C4 C6-C9 C23 = SparkFun:CAP_POL: Capacitor Polarized These are standard SMD and PTH capacitors. Normally 10uF, 47uF, and 100uF in electrolytic and tantalum varieties. Always verify the external diameter of the through hole cap, it varies with capacity, voltage, and manufacturer. The EIA devices should be standard.
C24-C26 = SparkFun:CAP: Capacitor Standard 0603 ceramic capacitor, and 0.1" leaded capacitor.
CAMERA1 CAMEREA2 = con-subd:F09: SUB-D
D1 D2 = diode:DIODE-: DIODE
D3 = SparkFun:DIODE: Diode These are standard reverse protection diodes and small signal diodes. SMA package can handle up to about 1A. SOD-323 can handle about 200mA. What the SOD-323 package when ordering, there are some mfgs out there that are 5-pin packages.
GYR1 = 9DoF-Stick-v12:SPARKFUN_ITG-3200: ITG-3200 3-axis gyro, digital output, qfn24 package
GYR2 GYR3 = SparkFun3:ST-GYRO
L1 = rcl:L-US: INDUCTOR, American symbol
Q1 Q3 = SparkFun:TRANSISTOR_NPN: Transistor NPN BJT configuration in SOT23 package. MMBT2222 is the common NPN we use. Double check BCE configuration again layout.
Q2 Q4 Q5 = SparkFun:MOSFET-NCHANNEL
Q100 = SparkFun:CRYSTAL: Crystals Various standard crystals. Proven footprints. Spark Fun Electronics SKU : COM-00534
R1-R5 R13-R19 R27-R31 R34-R38 = SparkFun:RESISTOR: Resistor Basic schematic elements and footprints for 0603, 1206, and PTH 1/10th watt (small) resistors.
R6-R9 R11 R12 R39-R44 = rcl:R-US_: RESISTOR, American symbol
R10 R20-R26 R32 R33 = SparkFun3:RESISTOR: Resistor Basic schematic elements and footprints for 0603, 1206, and PTH 1/10th watt (small) resistors.
ST = SparkFun:LED: LEDs Standard schematic elements and footprints for 5mm, 3mm, 1206, and 0603 sized LEDs. 5mm - Spark Fun Electronics SKU : COM-00529 (and others)
TMP100 = SparkFun:TMP102
U1 = SparkFun:HEX_CONVERTER
U2 = SparkFun:USD-SOCKET: microSD Socket Push-push type uSD socket. Schematic element and footprint production proven. Spark Fun Electronics SKU : PRT-00127. tDoc lines correctly indicate media card edge positions when inserting (unlocked, locked, depressed).
U3 = atmel-2005:ATMEGA*: MICROCONTROLLER 64/128/256 Kbytes FLASH 4 Kbytes EEPROM 8 Kbytes SRAM 86 General Purpose I/O pins 12-channels16-bit PWM 4 x Serial USARTs 16-channels 10-bit A/D
U4 = SparkFun:MAX232: RS232 Transceiver Very common IC. This is generically called 'MAX232', but works with the 3V equivalent MAX3232 generic ICs. Field tested and mother approved. Spark Fun Electronics SKU : COM-00316 (DIP) and COM-00589 (SMD)
U5 = SparkFun:LSM303DLH
U6 = SparkFun:V_REG_LDO: Voltage Regulator LDO Standard 150mA LDO voltage regulator in SOT-23 layout. Micrel part MIC5205. BP (by-pass) pin is used to lower output noise with 470pF cap.
U$2 = texas:TPS2034D
U$3 = SparkFun:L298_BRIDGE_DRIVER
U$5 U$18 = transistor-power:IRFR5505
U$17 = rocketsat:VN920SP
U$22 = SparkFun:MOSFET-NCHANNEL-SOIC8: N-Channel MOSFET IRF9410 and NDS8434 are common, SOIC-8 parts.
U$28-U$30 = SparkFun:OPTO_DARL_6N138S
X1 X5 = con-subd:F37: SUB-D
X2-X4 = con-subd:F15: SUB-D
XBEE1 XBEE2 = SparkFun:XBEE-1

## Board
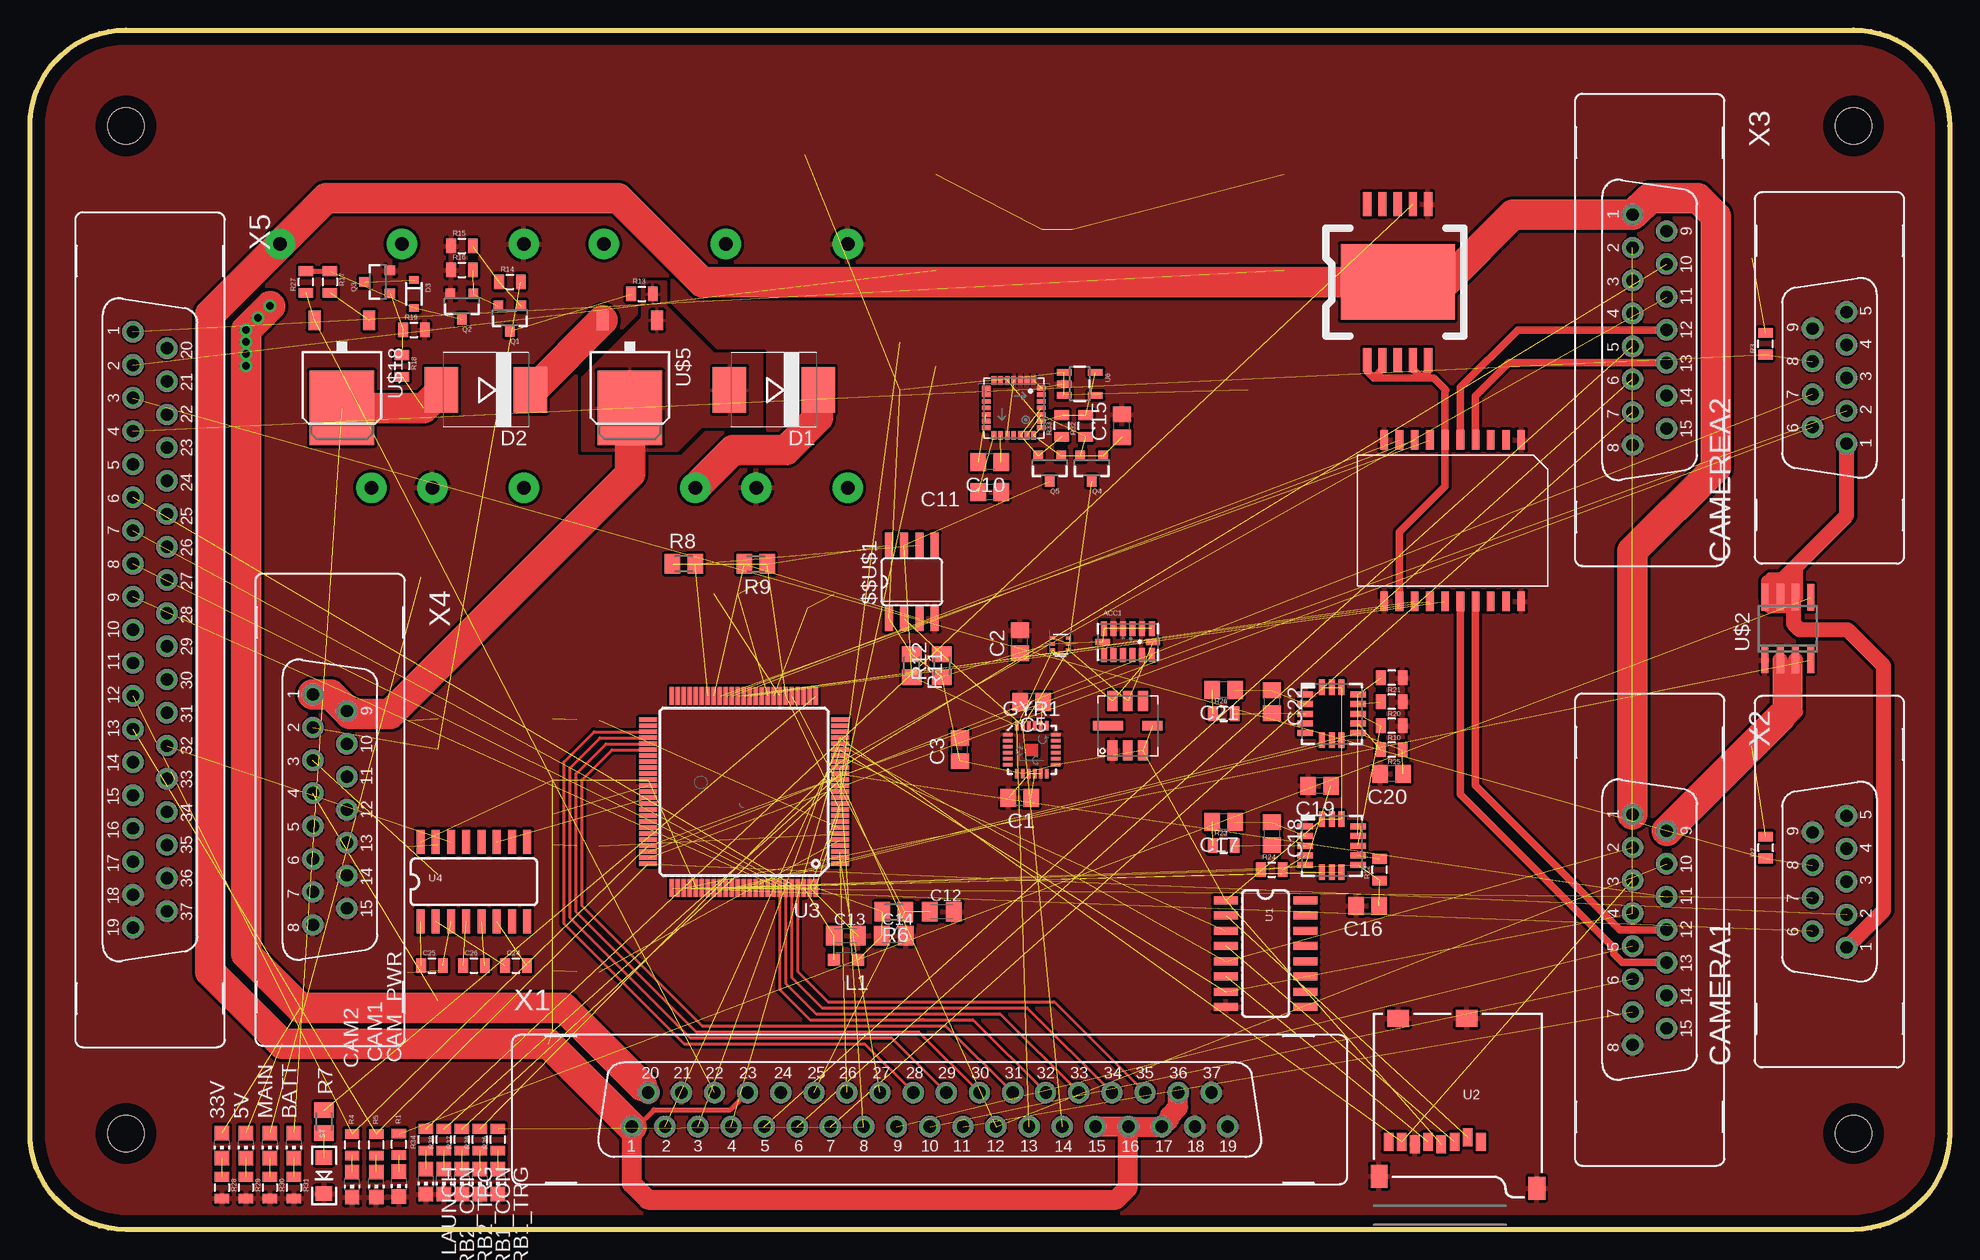
[diagram p3: board, top side]
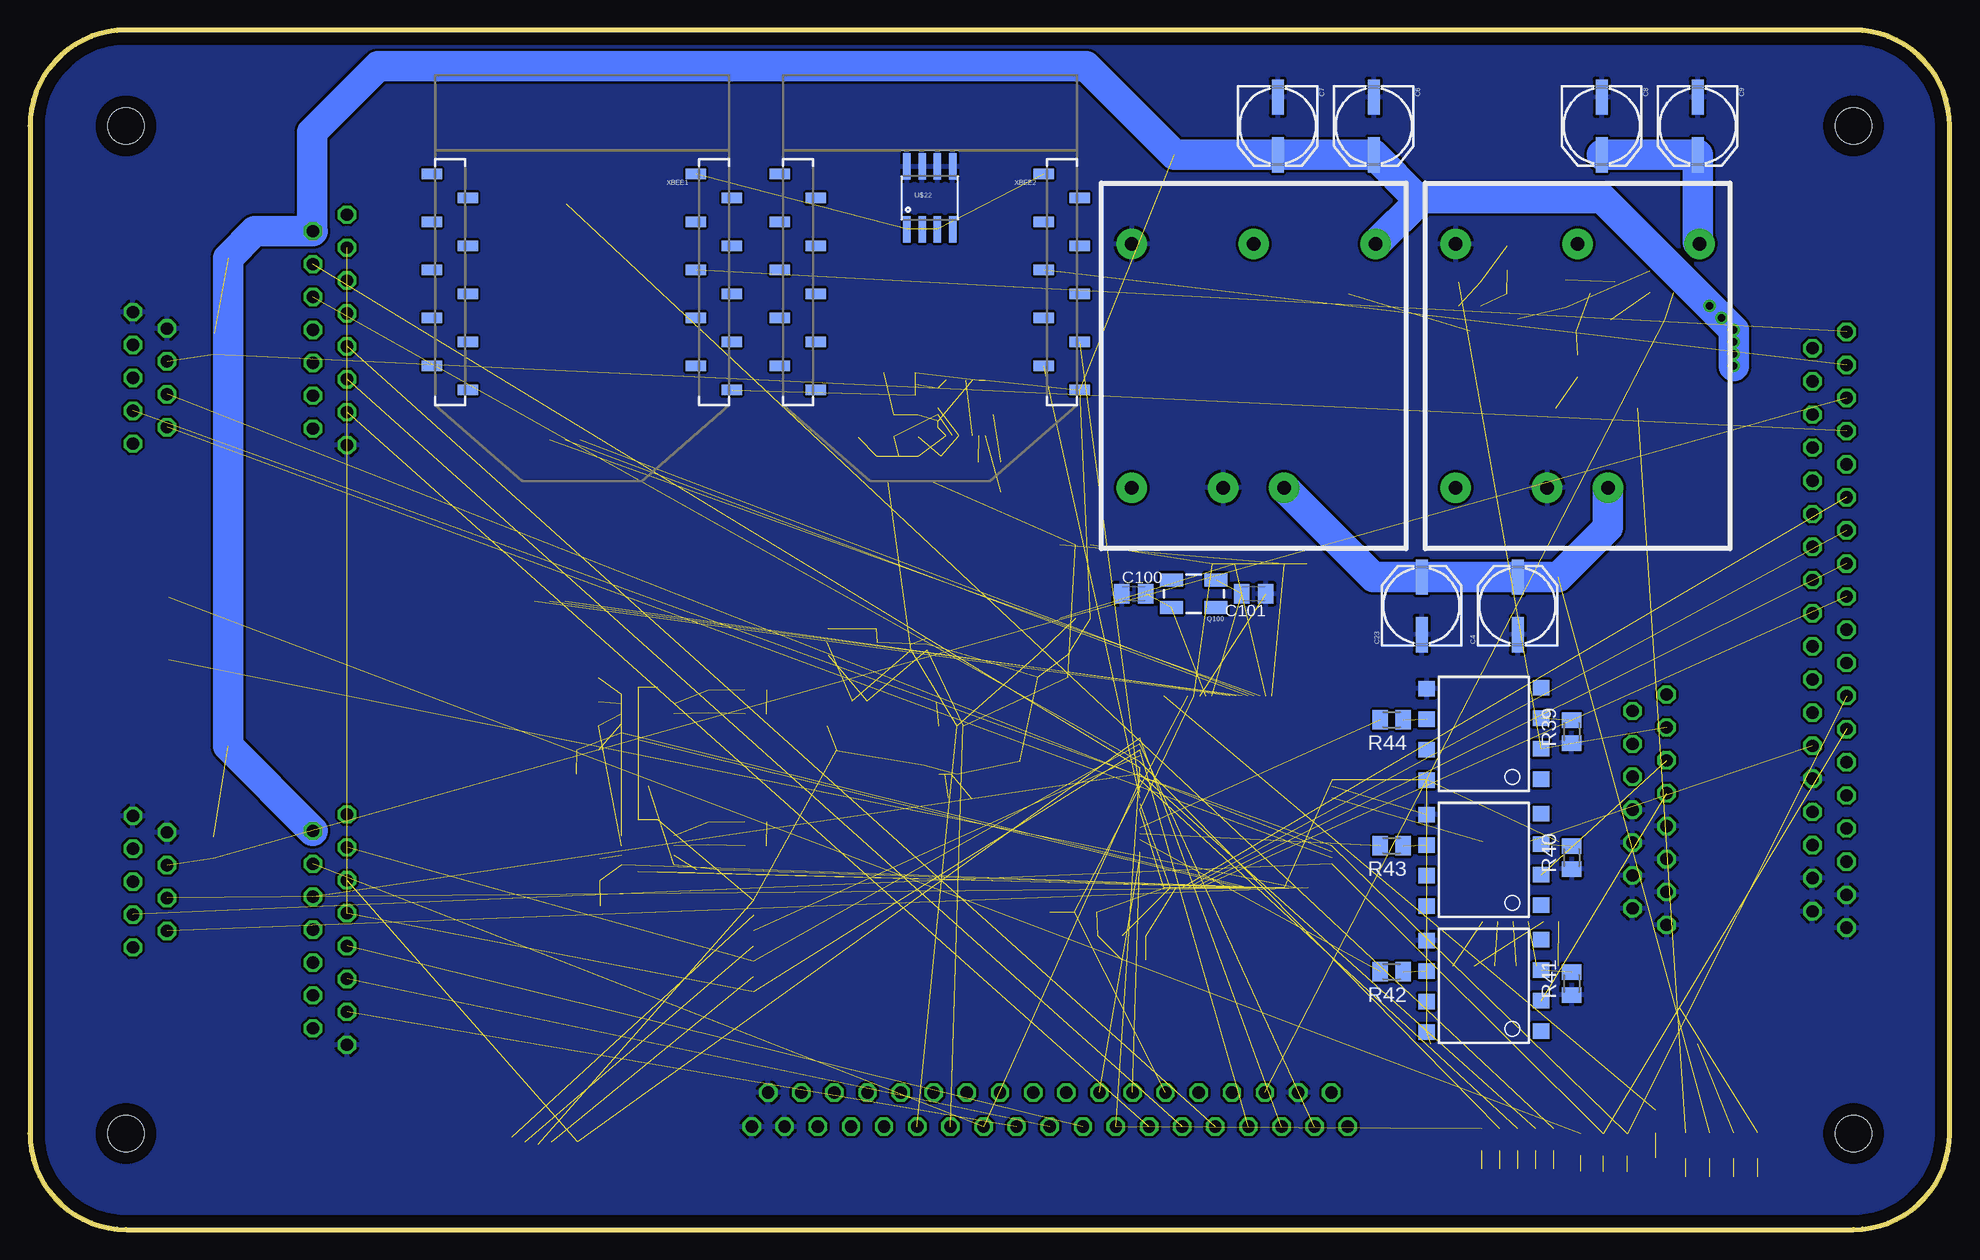
[diagram p4: board, bottom side, seen from below]

Size 160 x 100 mm. Coordinates in mm from the lower left corner, seen from the top.
Outline: 8,0 arc-90 0,8 0,92 arc-90 8,100 152,100 arc-90 160,92 160,8 arc-90 152,0 8,0
Copper layers (1*16): Top 0.035mm / dielectric 1.5mm / Bottom 0.035mm
Design rules "default": minimum track width 10mil, minimum drill 24mil, track to track 8mil, track to pad 8mil, pad to pad 8mil, via to via 8mil, smd to smd 8mil, copper to edge 40mil, drill to drill 8mil, minimum pad ring 10mil, minimum via ring 8mil, stop-mask expansion 4mil, vias tented up to drill 0mil, thermal gap 10mil
Holes 3 mm at 8,8 152,8 152,92 8,92

### Footprints (pad centres in the part's own frame; a part is rotated, then mirrored left to right if it is on the bottom)
UEI15 = drill 1.1 pad 2.54 round: ON/OFF 10.16,-10.16; TRM -10.16,0; VIN+ 10.16,2.54; VIN- 10.16,-2.54; VOUT+ -10.16,10.16; VOUT- -10.16,-10.16
CHIP-LED0805 = smd 1.2 x 1.2: A 0,-1.05; C 0,1.05
CUSTOM2_SO08 = smd 0.66 x 2.032: 1 -1.905,-3.073; 2 -0.635,-3.073; 3 0.635,-3.073; 4 1.905,-3.073; 5 1.905,3.073; 6 0.635,3.073; 7 -0.635,3.073; 8 -1.905,3.073
LGA14 = smd 0.5 x 1.2: 1 2,1.1; 2 1.2,1.1; 3 0.4,1.1; 4 -0.4,1.1; 5 -1.2,1.1; 6 -2,1.1; 8 -2,-1.1; 9 -1.2,-1.1; 10 -0.4,-1.1; 11 0.4,-1.1; 12 1.2,-1.1; 13 2,-1.1 | smd 1.2 x 0.5: 7 -2.1,0; 14 2.1,0
BMP085 = smd 1.67 x 0.8: 1 -2.065,1.27; 2 -2.065,0; 3 -2.065,-1.27; 5 2.065,-1.27; 6 2.065,0; 7 2.065,1.27 | smd 0.8 x 1.67: 4 0,-2.065 | smd 0.8 x 2.5: 8 0,1.65
C0805 = smd 1.3 x 1.5: 1 -0.95,0; 2 0.95,0
NIPPON_F80 = smd 2.95 x 1: + 2.4,0; - -2.4,0
C0805K = smd 1.3 x 1.6: 1 -1,0; 2 1,0
0805 = smd 0.8 x 1.2: 1 -0.9,0; 2 0.9,0
F09VB = drill 1.016 octagon: 1 -5.486,-1.422; 2 -2.743,-1.422; 3 0,-1.422; 4 2.743,-1.422; 5 5.486,-1.422; 6 -4.115,1.422; 7 -1.372,1.422; 8 1.372,1.422; 9 4.115,1.422
SMC = smd 2.8 x 3.8: A 3.7,0; C -3.7,0
SOD-323 = smd 0.63 x 0.83: 1 -1.15,0; 2 1.15,0
SPARKFUN_QFN-24 = smd 0.8 x 0.3: 1 -2,1.25; 2 -2,0.75; 3 -2,0.25; 4 -2,-0.25; 5 -2,-0.75; 6 -2,-1.25; 13 2,-1.25; 14 2,-0.75; 15 2,-0.25; 16 2,0.25; 17 2,0.75; 18 2,1.25 | smd 0.3 x 0.8: 7 -1.25,-2; 8 -0.75,-2; 9 -0.25,-2; 10 0.25,-2; 11 0.75,-2; 12 1.25,-2; 19 1.25,2; 20 0.75,2; 21 0.25,2; 22 -0.25,2; 23 -0.75,2; 24 -1.25,2
ST-GYRO = smd 1.3 x 0.5: 1 -2.2,1.6; 2 -2.2,0.8; 3 -2.2,0; 4 -2.2,-0.8; 5 -2.2,-1.6; 9 2.2,-1.6; 10 2.2,-0.8; 11 2.2,0; 12 2.2,0.8; 13 2.2,1.6 | smd 0.5 x 1.3: 6 -0.8,-2.2; 7 0,-2.2; 8 0.8,-2.2; 14 0.8,2.2; 15 0,2.2; 16 -0.8,2.2
L2012C = smd 1 x 1: 1 -1,0; 2 1,0
SOT23-3 = smd 0.8 x 0.9: 1 -0.95,-1; 2 0.95,-1; 3 0,1.1
CRYSTAL-SMD-5X3 = smd 1.9 x 1.1: 1 -1.85,-1.15; 2 1.85,-1.15; 3 1.85,1.15; 4 -1.85,1.15
M0805 = smd 1.3 x 1.6: 1 -0.95,0; 2 0.95,0
LED-1206 = smd 1.2 x 1.4: A -1.5,0; C 1.5,0
SOT563 = smd 0.25 x 0.4: 1 0.3,-0.06; 2 0.8,-0.06; 3 1.3,-0.06; 4 1.3,1.26; 5 0.8,1.26; 6 0.3,1.27
SO016 = smd 0.66 x 2.032: 1 -4.445,-3.315; 2 -3.175,-3.315; 3 -1.905,-3.315; 4 -0.635,-3.315; 5 0.635,-3.315; 6 1.905,-3.315; 7 3.175,-3.315; 8 4.445,-3.315; 9 4.445,3.315; 10 3.175,3.315; 11 1.905,3.315; 12 0.635,3.315; 13 -0.635,3.315; 14 -1.905,3.315; 15 -3.175,3.315; 16 -4.445,3.315
MICRO-SD-SOCKET-PP = smd 0.8 x 1.5: 1 -8.94,10.7; 2 -7.84,10.3; 3 -6.74,10.7; 4 -5.64,10.9; 5 -4.54,10.7; 6 -3.44,10.9; 7 -2.34,10.7; 8 -1.24,10.7 | smd 1.8 x 1.4: CD1 -2.05,0.4; CD2 -7.75,0.4 | smd 1.4 x 1.9: GND1 -13.6,14.55; GND3 -0.45,13.55
TQFP100 = smd 1.5 x 0.35: 1 -8,6; 2 -8,5.5; 3 -8,5; 4 -8,4.5; 5 -8,4; 6 -8,3.5; 7 -8,3; 8 -8,2.5; 9 -8,2; 10 -8,1.5; 11 -8,1; 12 -8,0.5; 13 -8,0; 14 -8,-0.5; 15 -8,-1; 16 -8,-1.5; 17 -8,-2; 18 -8,-2.5; 19 -8,-3; 20 -8,-3.5; 21 -8,-4; 22 -8,-4.5; 23 -8,-5; 24 -8,-5.5; 25 -8,-6; 51 8,-6; 52 8,-5.5; 53 8,-5; 54 8,-4.5; 55 8,-4; 56 8,-3.5; 57 8,-3; 58 8,-2.5; 59 8,-2; 60 8,-1.5; 61 8,-1; 62 8,-0.5; 63 8,0; 64 8,0.5; 65 8,1; 66 8,1.5; 67 8,2; 68 8,2.5; 69 8,3; 70 8,3.5; 71 8,4; 72 8,4.5; 73 8,5; 74 8,5.5; 75 8,6 | smd 0.35 x 1.5: 26 -6,-8; 27 -5.5,-8; 28 -5,-8; 29 -4.5,-8; 30 -4,-8; 31 -3.5,-8; 32 -3,-8; 33 -2.5,-8; 34 -2,-8; 35 -1.5,-8; 36 -1,-8; 37 -0.5,-8; 38 0,-8; 39 0.5,-8; 40 1,-8; 41 1.5,-8; 42 2,-8; 43 2.5,-8; 44 3,-8; 45 3.5,-8; 46 4,-8; 47 4.5,-8; 48 5,-8; 49 5.5,-8; 50 6,-8; 76 6,8; 77 5.5,8; 78 5,8; 79 4.5,8; 80 4,8; 81 3.5,8; 82 3,8; 83 2.5,8; 84 2,8; 85 1.5,8; 86 1,8; 87 0.5,8; 88 0,8; 89 -0.5,8; 90 -1,8; 91 -1.5,8; 92 -2,8; 93 -2.5,8; 94 -3,8; 95 -3.5,8; 96 -4,8; 97 -4.5,8; 98 -5,8; 99 -5.5,8; 100 -6,8
LGA28-5X5 = smd 0.7 x 0.4: 1 -2.3,1.65; 2 -2.3,1.1; 3 -2.3,0.55; 4 -2.3,0; 5 -2.3,-0.55; 6 -2.3,-1.1; 7 -2.3,-1.65; 15 2.3,-1.65; 16 2.3,-1.1; 17 2.3,-0.55; 18 2.3,0; 19 2.3,0.55; 20 2.3,1.1; 21 2.3,1.65 | smd 0.4 x 0.7: 8 -1.65,-2.3; 9 -1.1,-2.3; 10 -0.55,-2.3; 11 0,-2.3; 12 0.55,-2.3; 13 1.1,-2.3; 14 1.65,-2.3; 22 1.65,2.3; 23 1.1,2.3; 24 0.55,2.3; 25 0,2.3; 26 -0.55,2.3; 27 -1.1,2.3; 28 -1.65,2.3
SOT23-5 = smd 0.55 x 1.2: 1 -0.95,-1.3; 2 0,-1.3; 3 0.95,-1.3; 4 0.95,1.3; 5 -0.95,1.3
SO-08 = smd 0.6 x 2.2: 1 -1.905,-2.6; 2 -0.635,-2.6; 3 0.635,-2.6; 4 1.905,-2.6; 5 1.905,2.6; 6 0.635,2.6; 7 -0.635,2.6; 8 -1.905,2.6
POWERSO20 = smd 1.651 x 0.635: P$1 -6.731,5.715; P$2 -6.731,4.445; P$3 -6.731,3.175; P$4 -6.731,1.905; P$5 -6.731,0.635; P$6 -6.731,-0.635; P$7 -6.731,-1.905; P$8 -6.731,-3.175; P$9 -6.731,-4.445; P$10 -6.731,-5.715; P$11 6.731,-5.715; P$12 6.731,-4.445; P$13 6.731,-3.175; P$14 6.731,-1.905; P$15 6.731,-0.635; P$16 6.731,0.635; P$17 6.731,1.905; P$18 6.731,3.175; P$19 6.731,4.445; P$20 6.731,5.715
D-PAK_TO252AA = smd 1 x 1.6: 1 -2.28,-4.8; 3 2.28,-4.8 | smd 5.4 x 6.2: 4 0,2.5
POWERS0-10 = smd 2 x 0.7: C_SENSE -6.5,0; GND -6.5,2.54; INPUT -6.5,1.27; NC0 6.5,0; NC1 -6.5,-2.54; NC2 -6.5,-1.27; OUT0 6.5,-2.54; OUT1 6.5,-1.27; OUT2 6.5,1.27; OUT3 6.5,2.54 | smd 6.3 x 9.5: VCC 0,0
SO08 = smd 0.61 x 2.21: 1 -1.905,-2.616; 2 -0.635,-2.616; 3 0.635,-2.616; 4 1.905,-2.616; 5 1.905,2.616; 6 0.635,2.616; 7 -0.635,2.616; 8 -1.905,2.616
8-SMD = smd 1.3 x 1.4: 1 -3.96,-4.96; 2 -1.42,-4.96; 3 1.12,-4.96; 4 3.66,-4.96; 5 3.59,4.58; 6 1.05,4.58; 7 -1.49,4.58; 8 -4.03,4.58
F37VB = drill 1.016 octagon: 1 -24.841,-1.422; 2 -22.073,-1.422; 3 -19.329,-1.422; 4 -16.561,-1.422; 5 -13.792,-1.422; 6 -11.049,-1.422; 7 -8.28,-1.422; 8 -5.512,-1.422; 9 -2.769,-1.422; 10 0,-1.422; 11 2.769,-1.422; 12 5.512,-1.422; 13 8.28,-1.422; 14 11.049,-1.422; 15 13.818,-1.422; 16 16.561,-1.422; 17 19.329,-1.422; 18 22.098,-1.422; 19 24.841,-1.422; 20 -23.47,1.422; 21 -20.701,1.422; 22 -17.932,1.422; 23 -15.189,1.422; 24 -12.421,1.422; 25 -9.652,1.422; 26 -6.909,1.422; 27 -4.14,1.422; 28 -1.372,1.422; 29 1.372,1.422; 30 4.14,1.422; 31 6.909,1.422; 32 9.677,1.422; 33 12.421,1.422; 34 15.189,1.422; 35 17.958,1.422; 36 20.701,1.422; 37 23.47,1.422
F15VB = drill 1.016 octagon: 1 -9.601,-1.422; 2 -6.858,-1.422; 3 -4.115,-1.422; 4 -1.372,-1.422; 5 1.372,-1.422; 6 4.115,-1.422; 7 6.858,-1.422; 8 9.601,-1.422; 9 -8.23,1.422; 10 -5.486,1.422; 11 -2.743,1.422; 12 0,1.422; 13 2.743,1.422; 14 5.486,1.422; 15 8.23,1.422
XBEE-SMD = smd 1.7 x 0.85: 1 -12.5,20; 2 -9.5,18; 3 -12.5,16; 4 -9.5,14; 5 -12.5,12; 6 -9.5,10; 7 -12.5,8; 8 -9.5,6; 9 -12.5,4; 10 -9.5,2; 11 12.5,2; 12 9.5,4; 13 12.5,6; 14 9.5,8; 15 12.5,10; 16 9.5,12; 17 12.5,14; 18 9.5,16; 19 12.5,18; 20 9.5,20

### Placement (x,y rotation side)
3.3V  58,72 270 bottom
5.0V  31,72 270 bottom
5V  18,7 180 top
33V  16,7 180 top
$$U$1  73.5,54 0 top
ACC1  91.5,49 0 top
BAR100  91.5,42 90 top
BATT  22,7 180 top
C1  82.5,36 180 top
C2  82.5,49 90 top
C3  77.5,40 90 top
C4  36,52 90 bottom
C5  83.5,44 180 top
C6  48,92 270 bottom
C7  56,92 270 bottom
C8  29,92 270 bottom
C9  21,92 270 bottom
C10  80,64 180 top
C11  80,61.5 0 top
C12  76,26.5 0 top
C13  68,24.5 0 top
C14  72,24.5 0 top
C15  91,67 90 top
C16  111.5,27 180 top
C17  99.5,34 180 top
C18  103.5,33 270 top
C19  107.5,37 180 top
C20  113.5,38 180 top
C21  99.5,45 180 top
C22  103.5,44 270 top
C23  44,52 90 bottom
C24  40.5,22 0 top
C25  33.5,22 0 top
C26  37,22 0 top
C100  68,53 0 bottom
C101  58,53 180 bottom
CAM1  28.87,3.75 180 top
CAM2  26.85,3.75 180 top
CAM_PWR  30.75,3.79 180 top
CAMERA1  150,29 90 top
CAMEREA2  150,71 90 top
D1  62,70 180 top
D2  38,70 180 top
D3  32,78 270 top
GYR1  83.5,40 0 top
GYR2  108.5,43 0 top
GYR3  108.5,32 0 top
L1  68,22.5 180 top
LAUNCH  33,4 180 top
MAIN  20,7 180 top
PRB1_CON  37.5,4 180 top
PRB1_TRG  39,4 180 top
PRB2_CON  34.5,4 180 top
PRB2_TRG  36,4 180 top
Q1  40,76 180 top
Q2  36,77 180 top
Q3  29,79 90 top
Q4  88.5,63.5 180 top
Q5  85,63.5 180 top
Q100  63,53 180 bottom
R1  30.75,7.1 90 top
R2  144.68,31.84 90 top
R3  144.66,73.84 90 top
R4  26.85,7.06 90 top
R5  28.87,7.06 90 top
R6  72,26.5 180 top
R7  24.5,9 90 top
R8  54.5,55.5 0 top
R9  60.5,55.5 180 top
R10  113.5,42 180 top
R11  73.5,47 270 top
R12  76,47 90 top
R13  51,78 0 top
R14  40,79 0 top
R15  36,82 0 top
R16  36,80 0 top
R17  25,79 270 top
R18  31,72 270 top
R19  32,75 0 top
R20  113.5,44 180 top
R21  113.5,46 180 top
R22  112.5,30 90 top
R23  99.5,32 0 top
R24  103.5,30 0 top
R25  113.5,40 180 top
R26  99.5,43 0 top
R27  23,79 90 top
R28  16,3.5 270 top
R29  18,3.5 270 top
R30  20,3.5 270 top
R31  22,3.5 270 top
R32  88,67 90 top
R33  86,67 90 top
R34  33,7.5 90 top
R35  39,7.5 90 top
R36  37.5,7.5 90 top
R37  36,7.5 90 top
R38  34.5,7.5 90 top
R39  31.5,41.5 90 bottom
R40  31.5,31 90 bottom
R41  31.5,20.5 90 bottom
R42  46.5,21.5 180 bottom
R43  46.5,32 180 bottom
R44  46.5,42.5 180 bottom
ST  24.5,4.5 270 top
TMP100  86.5,48 90 top
U1  103,23 270 top
U2  112,18 180 top
U3  59.5,36.5 180 top
U4  37,29 0 top
U5  82,68.5 270 top
U6  87.5,70.5 270 top
U$2  146.52,50.1 0 top
U$3  118.59,59.1 270 top
U$5  50,71 180 top
U$17  114,79 270 top
U$18  26,71 180 top
U$22  85,86 0 bottom
U$28  39,20.5 90 bottom
U$29  39,31 90 bottom
U$30  39,41.5 90 bottom
X1  75,10 0 top
X2  135,25 270 top
X3  135,75 270 top
X4  25,35 270 top
X5  10,50 270 top
XBEE1  114,90 180 bottom
XBEE2  85,90 180 bottom

### Tracks (layer width: path | path; a pad name or v marks a point on that pad's centre or on a via)
1.8V  (9 unrouted)
3.3V  (via drill 0.6)  (30 unrouted)
  Top 1.27: 145.88,42.69 U$2.2 | U$2.3 147.16,43.16 145.5,41.5 145.1,41.9
  Top 1.93: 51,12 51,11.95 X1.20 51.53,11.47 51.5,11.5
  Top 2.54: v20,77 v19,76 v18,75 v18,74 v18,73 v18,72 18,23 22.5,18.5 44.5,18.5 51,12 | X2.9 145.1,41.9 145.88,42.69
  Bottom 2.54: v18,72 v18,75 v20,77 29,86 44,86 | 44,86 3.3V.VOUT+ | 44,86 44.4,86 C6.+ C7.+ 64.6,89.6 72,97 131,97 136.5,91.5 136.5,83.31 X3.9 141.27,83.23 143.5,81 143.5,40.31 X2.9
5V  (16 unrouted)
  Top 0.406: X1.1 50.58,8.58 52,10 58.39,10 X1.23
  Top 1.676: X1.16 X1.15 | X1.1 50.16,3.84 51.5,2.5 90.5,2.5 91.5,3.5 91.5,8.52 X1.16 | X1.36 95.7,10.2 95,9.5 95,9.25 X1.17 X1.16
  Top 2.54: X2.1 133.58,56.58 140.5,63.5 140.5,84.5 139,86 135,86 133.6,84.6 X3.1 123.6,84.6 118,79 U$17.VCC 56,79 49,86 24.68,86 5.0V.VOUT+ 15,76.32 15,21.5 21,15.5 43.24,15.5 X1.1
  Bottom 2.54: C8.+ C9.+ 21,82.32 5.0V.VOUT+
BASE_RST  (3 unrouted)
BASE_RXD  (1 unrouted)
BASE_TXD  (1 unrouted)
BATTERY_BACKUP  (2 unrouted)
CAM1_1  (1 unrouted)
CAM1_2  (1 unrouted)
CAM2_1  (1 unrouted)
CAM2_2  (1 unrouted)
CAM_PWR
  Top 0.61: U$2.8 144.62,54.12 145,54.5 146,54.5 | 146,54.5 147,54.5 147.16,54.34 U$2.6 | U$2.7 145.88,54 145.88,54.38 146,54.5
  Top 1.27: CAMEREA2.1 151.42,59.54 145.88,54 | U$2.6 147.16,54.84 147,55 147,52 | 147,52 147,50.5 147.5,50 151.5,50 154.5,47 154.5,26.59 CAMERA1.1 | 147,52 145,52 145,54 145.5,54 146.5,53
CAM_PWR_EN  (1 unrouted)
CAM_STAT_1  (3 unrouted)
CAM_STAT_2  (3 unrouted)
CS  (1 unrouted)
FLIGHT_TRIG  (1 unrouted)
GND  (11 unrouted)
  pour Bottom: 0,0 160,0 160,100 0,100
  pour Top (isolate 0.254, rank 6): 0,0 160,0 160,100 0,100
GPIO0
  Top 0.254: U3.53 47,41.5 44.5,39 44.5,25.5 54.5,15.5 69.55,15.5 X1.28
GPIO1
  Top 0.254: U3.54 47.5,41 45,38.5 45,26 55,16 71.79,16 X1.29
GPIO2
  Top 0.254: U3.55 48,40.5 45.5,38 45.5,26.5 55.5,16.5 74.06,16.5 X1.30
GPIO3
  Top 0.254: U3.56 48.5,40 46,37.5 46,27 56,17 76.33,17 X1.31
HP  (2 unrouted)
LAUNCH_TRIG  (2 unrouted)
LAUNCHER_EN  (1 unrouted)
LIGHT1  (1 unrouted)
  Top 0.254: X1.35 85.38,19 66.5,19 64,21.5 U3.97
LIGHT2  (1 unrouted)
  Top 0.254: X1.34 83.11,18.5 66,18.5 63.5,21 U3.96
LIGHT3  (1 unrouted)
  Top 0.254: X1.33 80.84,18 65.5,18 63,20.5 U3.95
LIGHT4  (1 unrouted)
  Top 0.254: X1.32 78.6,17.5 74.5,17.5 | 74.5,17.5 74,17.5 | U3.94 62.5,20 65,17.5 74.5,17.5
M1+  (1 unrouted)
M1-  (1 unrouted)
M1OUT+
  Top 0.61: U$3.P$4 120.5,69.5 123.26,72.26 X3.13
M1OUT-
  Top 0.61: U$3.P$5 119.22,70.22 124,75 X3.12
M2+  (1 unrouted)
M2-  (1 unrouted)
M2OUT+
  Top 0.61: U$3.P$16 119.22,36.27 132,23.5 132,23 132.74,22.26 X2.13
M2OUT-
  Top 0.61: U$3.P$17 120.5,37.01 132.5,25 X2.12
MAIN_PWR
  Top 2.54: X4.1 25.05,44.6 X4.9 26.65,43 30,43 50,63 U$5.4
  pour Top: 53,79 51,79 51,76 46,71 46,65 54,65 56,67 61,67 61,73 57,73 53,77
MISO  (4 unrouted)
MOSI  (4 unrouted)
N$1  (1 unrouted)
N$2  (1 unrouted)
N$3  (1 unrouted)
N$4  (1 unrouted)
N$5  (2 unrouted)
N$6  (2 unrouted)
N$7  (2 unrouted)
N$8
  Top 2.54: D2.C 41.92,70 U$5.3
N$9  (2 unrouted)
N$10  (1 unrouted)
N$11  (1 unrouted)
N$12  (1 unrouted)
N$13  (2 unrouted)
N$14  (2 unrouted)
N$15  (2 unrouted)
  Top 2.54: U$18.4 32.8,68.5 D2.A
N$16  (1 unrouted)
N$17  (1 unrouted)
N$18  (2 unrouted)
N$19  (1 unrouted)
N$21  (1 unrouted)
N$22  (1 unrouted)
N$23  (1 unrouted)
N$24  (1 unrouted)
N$25
  Top 0.61: U$17.OUT0 111.46,71.54 112,71 | U$17.OUT3 116.54,71.54 116,71 | U$17.OUT2 115.27,71.73 116,71 | U$17.OUT1 112.73,71.73 112,71 | 116,71 112,71 | 116,71 117,71 118,70 117.95,69.95 U$3.P$6 117.95,61.95 114.14,58.15 U$3.P$12
N$26  (2 unrouted)
N$27  (1 unrouted)
N$28  (1 unrouted)
N$29  (1 unrouted)
N$30  (1 unrouted)
N$31  (2 unrouted)
N$32  (1 unrouted)
N$33  (2 unrouted)
N$34  (1 unrouted)
N$35  (1 unrouted)
N$36  (1 unrouted)
N$37  (1 unrouted)
N$38  (1 unrouted)
N$39  (1 unrouted)
N$40  (1 unrouted)
N$41  (1 unrouted)
N$42  (1 unrouted)
N$43  (1 unrouted)
N$44  (2 unrouted)
  Top 0.406: R27.2 R17.1
N$45  (2 unrouted)
N$46  (1 unrouted)
N$47  (2 unrouted)
N$48  (1 unrouted)
N$49  (1 unrouted)
N$50  (1 unrouted)
N$51  (1 unrouted)
N$52  (1 unrouted)
N$53  (4 unrouted)
N$54  (1 unrouted)
N$55  (1 unrouted)
N$56  (1 unrouted)
N$57  (1 unrouted)
N$58  (1 unrouted)
N$59  (1 unrouted)
N$60  (1 unrouted)
N$61  (1 unrouted)
N$62  (1 unrouted)
N$63  (1 unrouted)
N$64  (1 unrouted)
PD  (2 unrouted)
PROBE1_CONTACT  (2 unrouted)
PROBE1_RST  (1 unrouted)
PROBE1_RXD  (1 unrouted)
PROBE1_TRIG  (3 unrouted)
PROBE1_TXD  (1 unrouted)
PROBE2_CONTACT  (2 unrouted)
PROBE2_RST  (1 unrouted)
PROBE2_RXD  (1 unrouted)
PROBE2_TRIG  (3 unrouted)
PROBE2_TXD  (1 unrouted)
PWM1  (1 unrouted)
PWM2  (1 unrouted)
RSSI1  (1 unrouted)
RSSI2  (1 unrouted)
SCK  (4 unrouted)
SCL  (7 unrouted)
SCL1.8V  (3 unrouted)
SDA  (7 unrouted)
SDA1.8V  (3 unrouted)
SEP_TRIG  (1 unrouted)
ST  (2 unrouted)
TELEM_RX  (1 unrouted)
TELEM_TX  (1 unrouted)
TMP1_+  (2 unrouted)
TMP2_+  (2 unrouted)
VIN  (1 unrouted)
  Top 2.54: 3.3V.VIN+ 58.62,65 63,65 65.7,67.7 D1.C
  Bottom 2.54: 3.3V.VIN+ 48.02,54.4 C23.+ C4.+ 32.6,54.4 28.46,58.54 5.0V.VIN+
XBEE-RX2  (1 unrouted)
XBEE-TX2  (1 unrouted)
XOUT-1X  (3 unrouted)
XOUT-4X  (1 unrouted)
YOUT-1X  (3 unrouted)
YOUT-4X  (1 unrouted)
ZOUT-1X  (3 unrouted)
ZOUT-4X  (1 unrouted)